# EAGLE design untitled (EAGLE 9.6.2)
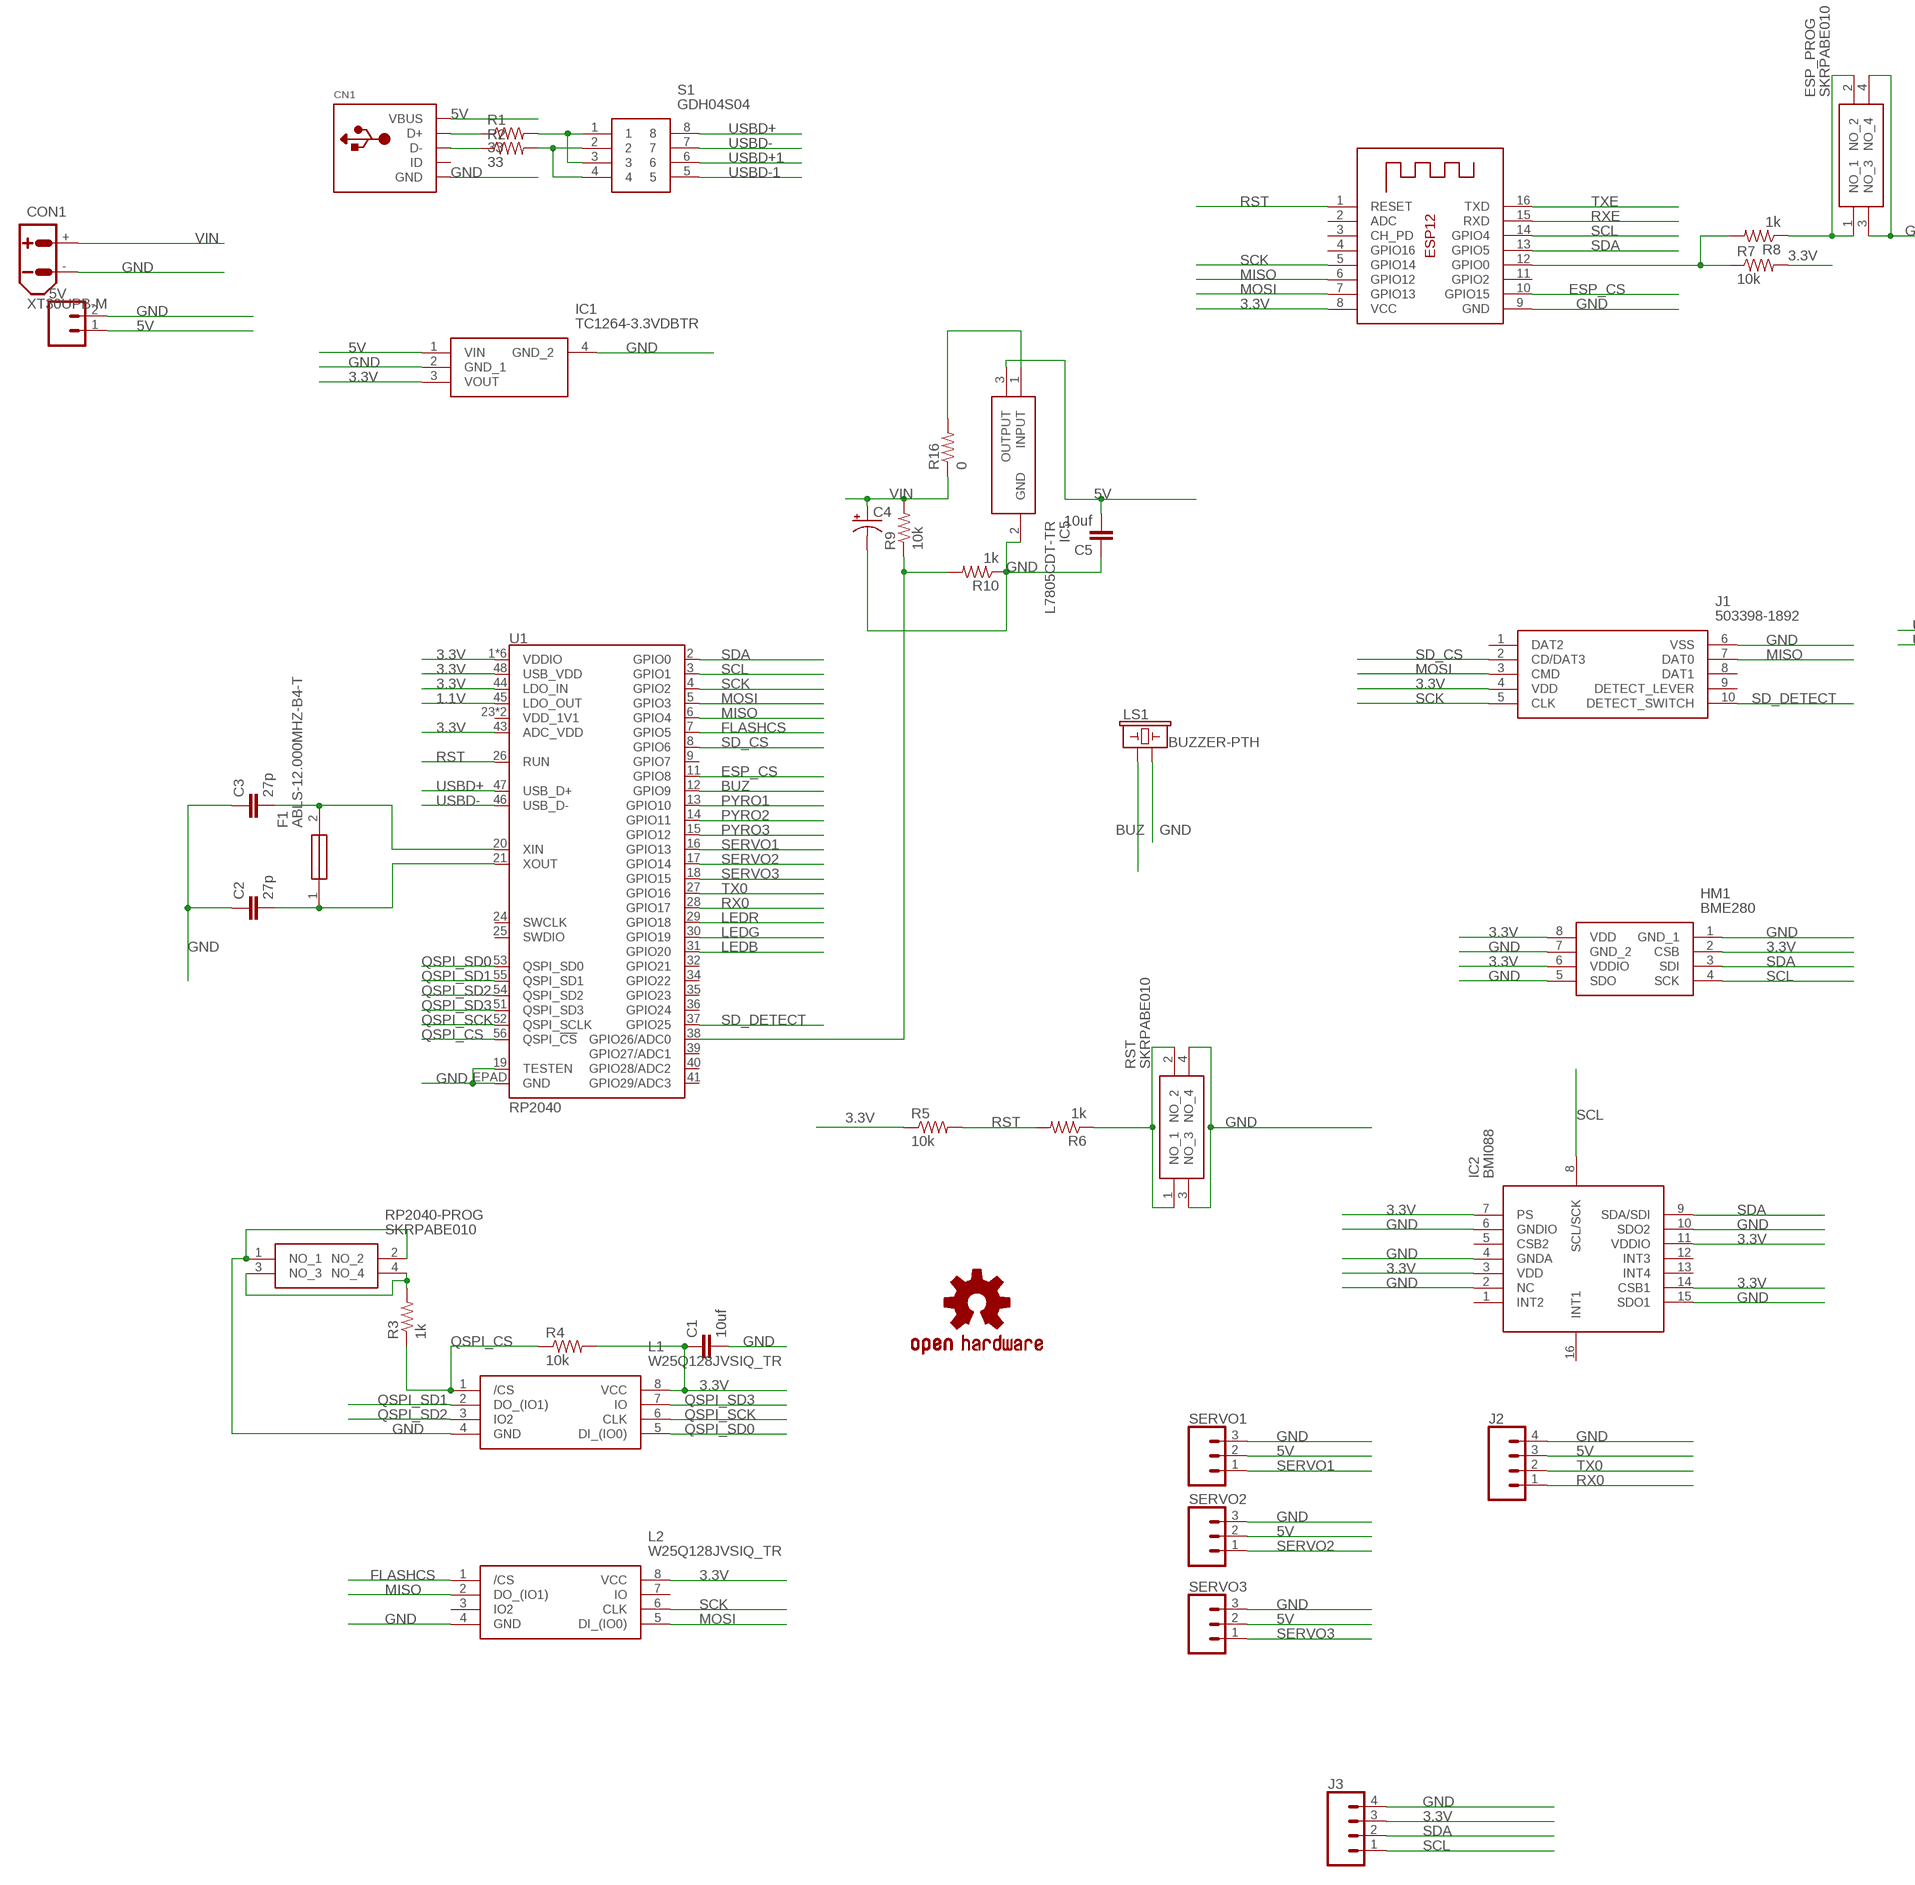
[diagram p0: schematic, sheet 1, part 1 of 2]
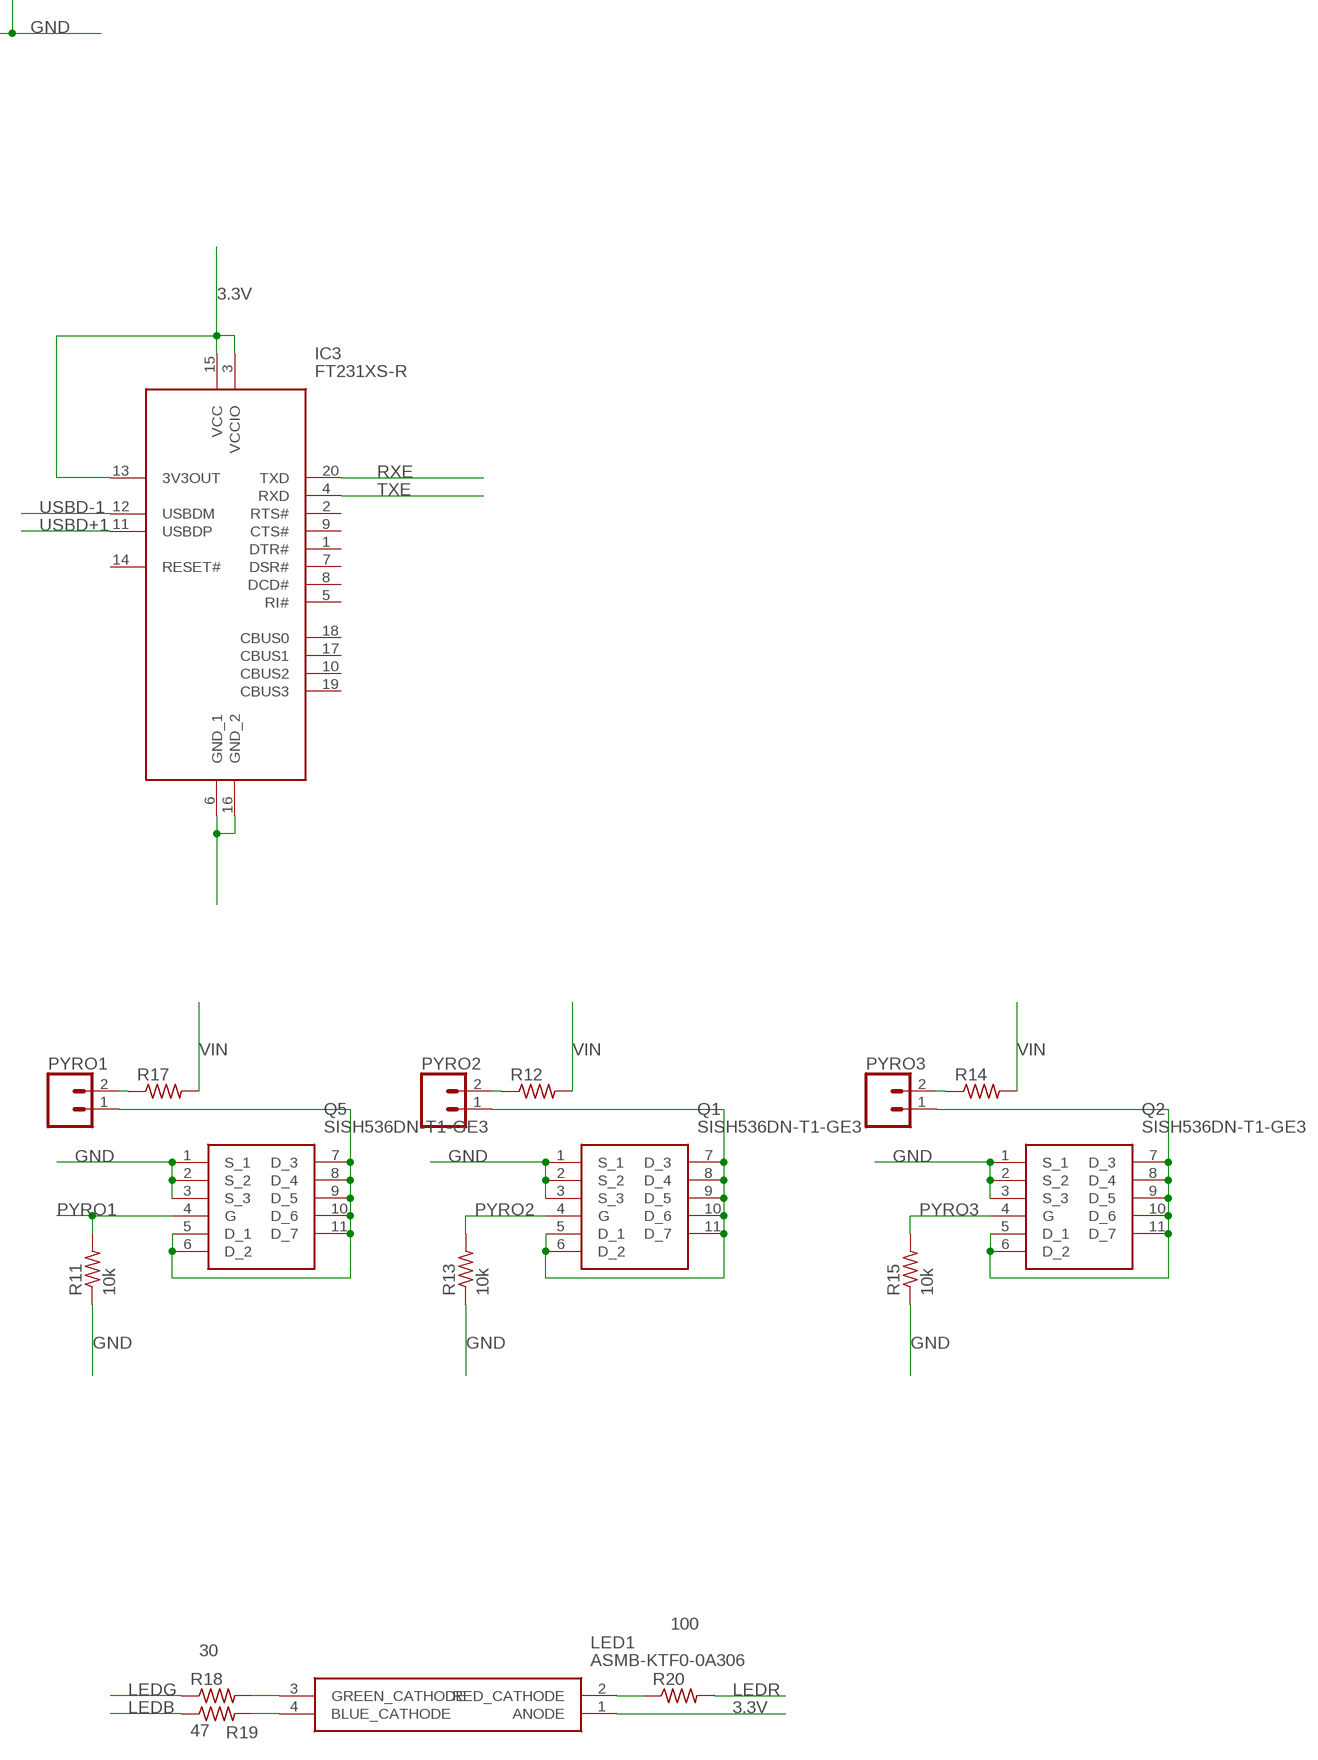
[diagram p1: schematic, sheet 1, part 2 of 2]

## Parts
5V  CONN_02  [1X02]
C1  10uf  C-EUC0805  [C0805]
C2  27p  C-EUC0805  [C0805]
C3  27p  C-EUC0805  [C0805]
C4  CPOL-USE3.5-8  [E3,5-8]
C5  10uf  C-EUC0805  [C0805]
CN1  USBMINIB  [USB-MINIB]
CON1  XT30UPB-M  [XT30UPB-M]
ESP_PROG  SKRPABE010  [SKRPABE010]
F1  ABLS-12.000MHZ-B4-T  [HC/49US-(AT49)_1]
HM1  BME280  [BME280]
IC1  TC1264-3.3VDBTR  [SOT230P700X180-4N]
IC2  BMI088  [BMI088]
IC3  FT231XS-R  [SOP64P599X175-20N]
IC5  L7805CDT-TR  [L7805CDTTR]
J1  503398-1892  [503398-1892]
J2  CONN_04  [1X04]
J3  CONN_04  [1X04]
L1  W25Q128JVSIQ_TR  [SOIC127P780X195-8N]
L2  W25Q128JVSIQ_TR  [SOIC127P780X195-8N]
LED1  ASMB-KTF0-0A306  [ASMBKTF00A306]
LOGO1  OSHW-LOGOS  [OSHW-LOGO-S]
LS1  BUZZER-PTH  [BUZZER-12MM]
PYRO1  CONN_025MM  [SCREWTERMINAL-5MM-2]
PYRO2  CONN_025MM  [SCREWTERMINAL-5MM-2]
PYRO3  CONN_025MM  [SCREWTERMINAL-5MM-2]
Q1  SISH536DN-T1-GE3  [SQSA80ENWT1_GE3]
Q2  SISH536DN-T1-GE3  [SQSA80ENWT1_GE3]
Q5  SISH536DN-T1-GE3  [SQSA80ENWT1_GE3]
R1  33  R-US_M0805  [M0805]
R2  33  R-US_M0805  [M0805]
R3  1k  R-US_M0805  [M0805]
R4  10k  R-US_M0805  [M0805]
R5  10k  R-US_M0805  [M0805]
R6  1k  R-US_M0805  [M0805]
R7  10k  R-US_M0805  [M0805]
R8  1k  R-US_M0805  [M0805]
R9  10k  R-US_M0805  [M0805]
R10  1k  R-US_M0805  [M0805]
R11  10k  R-US_M0805  [M0805]
R12  0  R-US_R2512  [R2512]
R13  10k  R-US_M0805  [M0805]
R14  0  R-US_R2512  [R2512]
R15  10k  R-US_M0805  [M0805]
R16  0  R-US_R2512  [R2512]
R17  0  R-US_R2512  [R2512]
R18  30  R-US_M0805  [M0805]
R19  47  R-US_M0805  [M0805]
R20  100  R-US_M0805  [M0805]
RP2040-PROG  SKRPABE010  [SKRPABE010]
RST  SKRPABE010  [SKRPABE010]
S1  GDH04S04  [SOIC127P813X256-8N]
SERVO1  CONN_03  [1X03]
SERVO2  CONN_03  [1X03]
SERVO3  CONN_03  [1X03]
U1  RP2040  [QFN-56]
X1  ESP-12  [ESP-12]

## Nets
1.1V: U1.45(LDO_OUT)
3.3V: C1.1 HM1.2(CSB) HM1.6(VDDIO) HM1.8(VDD) IC1.3(VOUT) IC2.3(VDD) IC2.7(PS) IC2.11(VDDIO) IC2.14(CSB1) IC3.3(VCCIO) IC3.13(3V3OUT) IC3.15(VCC) J1.4(VDD) J3.3 L1.8(VCC) L2.8(VCC) LED1.1(ANODE) R4.2 R5.1 R7.2 U1.1(VDDIO) U1.10(VDDIO) U1.22(VDDIO) U1.33(VDDIO) U1.42(VDDIO) U1.43(ADC_VDD) U1.44(LDO_IN) U1.48(USB_VDD) U1.49(VDDIO) X1.8(VCC)
5V: 5V.1 C5.2 CN1.VBUS IC1.1(VIN) IC5.3(OUTPUT) J2.3 SERVO1.2 SERVO2.2 SERVO3.2
BUZ: LS1.+ U1.12(GPIO9)
ESP_CS: U1.11(GPIO8) X1.10(GPIO15)
FLASHCS: L2.1(/CS) U1.7(GPIO5)
GND: 5V.2 C1.2 C2.1 C3.1 C4.- C5.1 CN1.GND CON1.- ESP_PROG.3(NO_3) ESP_PROG.4(NO_4) HM1.1(GND_1) HM1.5(SDO) HM1.7(GND_2) IC1.2(GND_1) IC1.4(GND_2) IC2.2(NC) IC2.4(GNDA) IC2.6(GNDIO) IC2.10(SDO2) IC2.15(SDO1) IC5.2(GND) J1.6(VSS) J2.4 J3.4 L1.4(GND) L2.4(GND) LS1.- Q1.1(S_1) Q1.2(S_2) Q1.3(S_3) Q2.1(S_1) Q2.2(S_2) Q2.3(S_3) Q5.1(S_1) Q5.2(S_2) Q5.3(S_3) R10.1 R11.1 R13.1 R15.1 RP2040-PROG.1(NO_1) RP2040-PROG.2(NO_2) RST.3(NO_3) RST.4(NO_4) SERVO1.3 SERVO2.3 SERVO3.3 U1.19(TESTEN) U1.EPAD(GND) X1.9(GND)
LEDB: R19.1 U1.31(GPIO20)
LEDG: R18.1 U1.30(GPIO19)
LEDR: R20.2 U1.29(GPIO18)
MISO: J1.7(DAT0) L2.2(DO_(IO1)) U1.6(GPIO4) X1.6(GPIO12)
MOSI: J1.3(CMD) L2.5(DI_(IO0)) U1.5(GPIO3) X1.7(GPIO13)
N$1: PYRO2.2 R12.1
N$2: R3.2 RP2040-PROG.3(NO_3) RP2040-PROG.4(NO_4)
N$3: ESP_PROG.1(NO_1) ESP_PROG.2(NO_2) R8.1
N$4: R6.1 RST.1(NO_1) RST.2(NO_2)
N$5: CN1.D+ R1.1
N$6: CN1.D- R2.1
N$7: PYRO2.1 Q1.5(D_1) Q1.6(D_2) Q1.7(D_3) Q1.8(D_4) Q1.9(D_5) Q1.10(D_6) Q1.11(D_7)
N$8: PYRO3.2 R14.1
N$9: PYRO1.1 Q5.5(D_1) Q5.6(D_2) Q5.7(D_3) Q5.8(D_4) Q5.9(D_5) Q5.10(D_6) Q5.11(D_7)
N$10: R7.1 R8.2 X1.12(GPIO0)
N$11: PYRO3.1 Q2.5(D_1) Q2.6(D_2) Q2.7(D_3) Q2.8(D_4) Q2.9(D_5) Q2.10(D_6) Q2.11(D_7)
N$12: IC3.6(GND_1) IC3.16(GND_2)
N$13: R1.2 S1.1 S1.3
N$14: IC5.1(INPUT) R16.2
N$16: PYRO1.2 R17.1
N$17: R2.2 S1.2 S1.4
N$18: C3.2 F1.2 U1.20(XIN)
N$19: C2.2 F1.1 U1.21(XOUT)
N$23: LED1.3(GREEN_CATHODE) R18.2
N$24: R9.1 R10.2 U1.38(GPIO26/ADC0)
N$25: LED1.4(BLUE_CATHODE) R19.2
N$26: LED1.2(RED_CATHODE) R20.1
PYRO1: Q5.4(G) R11.2 U1.13(GPIO10)
PYRO2: Q1.4(G) R13.2 U1.14(GPIO11)
PYRO3: Q2.4(G) R15.2 U1.15(GPIO12)
QSPI_CS: L1.1(/CS) R3.1 R4.1 U1.56(QSPI_!CS!)
QSPI_SCK: L1.6(CLK) U1.52(QSPI_SCLK)
QSPI_SD0: L1.5(DI_(IO0)) U1.53(QSPI_SD0)
QSPI_SD1: L1.2(DO_(IO1)) U1.55(QSPI_SD1)
QSPI_SD2: L1.3(IO2) U1.54(QSPI_SD2)
QSPI_SD3: L1.7(IO) U1.51(QSPI_SD3)
RST: R5.2 R6.2 U1.26(RUN) X1.1(RESET)
RX0: J2.1 U1.28(GPIO17)
RXE: IC3.20(TXD) X1.15(RXD)
SCK: J1.5(CLK) L2.6(CLK) U1.4(GPIO2) X1.5(GPIO14)
SCL: HM1.4(SCK) IC2.8(SCL/SCK) J3.1 U1.3(GPIO1) X1.14(GPIO4)
SD_CS: J1.2(CD/DAT3) U1.8(GPIO6)
SD_DETECT: J1.10(DETECT_SWITCH) U1.37(GPIO25)
SDA: HM1.3(SDI) IC2.9(SDA/SDI) J3.2 U1.2(GPIO0) X1.13(GPIO5)
SERVO1: SERVO1.1 U1.16(GPIO13)
SERVO2: SERVO2.1 U1.17(GPIO14)
SERVO3: SERVO3.1 U1.18(GPIO15)
TX0: J2.2 U1.27(GPIO16)
TXE: IC3.4(RXD) X1.16(TXD)
USBD+: S1.8 U1.47(USB_D+)
USBD+1: IC3.11(USBDP) S1.6
USBD-: S1.7 U1.46(USB_D-)
USBD-1: IC3.12(USBDM) S1.5
VIN: C4.+ CON1.+ R9.2 R12.2 R14.2 R16.1 R17.2
Unconnected: CN1.ID IC2.1(INT2) IC2.5(CSB2) IC2.12(INT3) IC2.13(INT4) IC2.16(INT1) IC3.1(DTR#) IC3.2(RTS#) IC3.5(RI#) IC3.7(DSR#) IC3.8(DCD#) IC3.9(CTS#) IC3.10(CBUS2) IC3.14(RESET#) IC3.17(CBUS1) IC3.18(CBUS0) IC3.19(CBUS3) J1.1(DAT2) J1.8(DAT1) J1.9(DETECT_LEVER) L2.3(IO2) L2.7(IO) U1.9(GPIO7) U1.23(VDD_1V1) U1.24(SWCLK) U1.25(SWDIO) U1.32(GPIO21) U1.34(GPIO22) U1.35(GPIO23) U1.36(GPIO24) U1.39(GPIO27/ADC1) U1.40(GPIO28/ADC2) U1.41(GPIO29/ADC3) U1.50(VDD_1V1) X1.2(ADC) X1.3(CH_PD) X1.4(GPIO16) X1.11(GPIO2)

## Library data of the parts
5V = SparkFun-Connectors:CONN_02: Multi connection point. Often used as Generic Header-pin footprint for 0.1 inch spaced/style header connections On any of the 0.1 inch spaced packages, you can populate with these: Break Away Headers - Straight <https://www.sparkfun.com/products/116> (PRT-00116) Break Away Male Headers - Right Angle <https://www.sparkfun.com/products/553> (PRT-00553) Female Headers <https://www.sparkfun.com/products/115> (PRT-00115) Break Away Headers - Machine Pin <https://www.sparkfun.com/products/117> (PRT-00117) Break Away Female Headers - Swiss Machine Pin <https://www.sparkfun.com/products/743> (PRT-00743) For SCREWTERMINALS and SPRING TERMINALS visit here: Screw Terimnals on SparkFun.com <https://www.sparkfun.com/search/results?term=Screw+Terminals> (5mm/3.5mm/2.54mm spacing) This device is also useful as a general connection point to wire up your design to another part of your project. Our various solder wires solder well into these plated through hole pads. Hook-Up Wire - Assortment (Stranded, 22 AWG) <https://www.sparkfun.com/products/11375> (PRT-11375) Hook-Up Wire - Assortment (Solid Core, 22 AWG) <https://www.sparkfun.com/products/11367> (PRT-11367) View the entire wire category on our website here <https://www.sparkfun.com/categories/141> Special notes: Molex polarized connector foot print use with: PRT-08233 with associated crimp pins and housings. 2.54_SCREWTERM for use with PRT-10571. 3.5mm Screw Terminal footprints for PRT-08084 5mm Screw Terminal footprints for use with PRT-08432
C1-C3 C5 = rcl:C-EU: CAPACITOR, European symbol; SPICEPREFIX: C
C4 = rcl:CPOL-US: POLARIZED CAPACITOR, American symbol; SPICEPREFIX: C
CN1 = adafruit:USB: USB Connectors USBMINIB - Surface Mount Female Mini-B USB Connector 4UConnector: 06564 By microbuilder.eu Thru-hole RA Female Mini-B USB Connector 4UConnector: 18732 By ladyada.net
CON1 = amass:XT30: AMASS XT30 connector Store in Japan AMASS XT30 connector <https://szc.jp/ams-xt30>
ESP_PROG RP2040-PROG RST = SKRPABE010:SKRPABE010: Switch Tactile N.O. SPST Button J-Bend 0.05A 16VDC 1.57N SMD Automotive T/R Source: Datasheet <https://datasheet.lcsc.com/szlcsc/ALPS-Electric-SKRPABE010_C115360.pdf>; DESCRIPTION: Switch Tactile N.O. SPST Button J-Bend 0.05A 16VDC 1.57N SMD Automotive T/R; HEIGHT: 2.5mm; MANUFACTURER_NAME: ALPS Electric; MANUFACTURER_PART_NUMBER: SKRPABE010; MOUSER_PART_NUMBER: 688-SKRPAB; MOUSER_PRICE-STOCK: https://www.mouser.co.uk/ProductDetail/Alps-Alpine/SKRPABE010?qs=m0BA540hBPe1GpcSf%2FZ5Yw%3D%3D
F1 = ABLS-12.000MHZ-B4-T:ABLS-12.000MHZ-B4-T: ABRACON - ABLS-12.000MHZ-B4-T - CRYSTAL, 12MHZ, 18PF, HC-49US Source: Datasheet <https://componentsearchengine.com/Datasheets/2/ABLS-12.000MHZ-B4-T.pdf>; DESCRIPTION: ABRACON - ABLS-12.000MHZ-B4-T - CRYSTAL, 12MHZ, 18PF, HC-49US; HEIGHT: mm; MANUFACTURER_NAME: ABRACON; MANUFACTURER_PART_NUMBER: ABLS-12.000MHZ-B4-T; MOUSER_PART_NUMBER: 815-ABLS-12.0M-T; MOUSER_PRICE-STOCK: https://www.mouser.co.uk/ProductDetail/ABRACON/ABLS-12.000MHZ-B4-T?qs=yTU0IcKoRlGSQ8ooxPPVnQ%3D%3D
HM1 = BME280:BME280: Board Mount Humidity Sensors Source: Datasheet <https://datasheet.datasheetarchive.com/originals/distributors/DKDS-24/462906.pdf>; DESCRIPTION: Board Mount Humidity Sensors; HEIGHT: mm; MANUFACTURER_NAME: BOSCH; MANUFACTURER_PART_NUMBER: BME280; MOUSER_PART_NUMBER: 262-BME280; MOUSER_PRICE-STOCK: https://www.mouser.co.uk/ProductDetail/Bosch-Sensortec/BME280?qs=2OnyuXx6vpj2fK9HX7qb3g%3D%3D
IC1 = TC1264-3.3VDBTR:TC1264-3.3VDBTR: LDO Voltage Regulators 800mA Fixed Output Source: Datasheet; DESCRIPTION: LDO Voltage Regulators 800mA Fixed Output; HEIGHT: 1.8mm; MANUFACTURER_NAME: Microchip; MANUFACTURER_PART_NUMBER: TC1264-3.3VDBTR; MOUSER_PART_NUMBER: 579-TC1264-3.3VDBTR; MOUSER_PRICE-STOCK: https://www.mouser.co.uk/ProductDetail/Microchip-Technology-Atmel/TC1264-3.3VDBTR?qs=EkZBwCRGcSs72PT5fOeaFg%3D%3D
IC2 = BMI088:BMI088: Inertial Measurement Unit Digital Output 2.5V/3.3V Automotive Source: Datasheet <https://datasheet.datasheetarchive.com/originals/distributors/Datasheets_SAMA/994c3bf88e91a9e9fead6a819d348e4d.pdf>; DESCRIPTION: Inertial Measurement Unit Digital Output 2.5V/3.3V Automotive; HEIGHT: 1.45mm; MANUFACTURER_NAME: BOSCH; MANUFACTURER_PART_NUMBER: BMI088; MOUSER_PART_NUMBER: 262-BMI088; MOUSER_PRICE-STOCK: https://www.mouser.co.uk/ProductDetail/Bosch-Sensortec/BMI088?qs=f9yNj16SXrIMFspTV6RB6Q%3D%3D
IC3 = FT231XS-R:FT231XS-R: FTDI Chip FT231XS-R, Interface RS232, RS422, RS485, SIE, UART 3MBd, 5 V, 20-pin, SSOP Source: Datasheet <https://datasheet.datasheetarchive.com/originals/distributors/Datasheets_SAMA/824938d1687833d6997706543241551a.pdf>; DESCRIPTION: FTDI Chip FT231XS-R, Interface RS232, RS422, RS485, SIE, UART 3MBd, 5 V, 20-pin, SSOP; HEIGHT: 1.753mm; MANUFACTURER_NAME: FTDI Chip; MANUFACTURER_PART_NUMBER: FT231XS-R; MOUSER_PART_NUMBER: 895-FT231XS-R; MOUSER_PRICE-STOCK: https://www.mouser.co.uk/ProductDetail/FTDI/FT231XS-R?qs=Gp1Yz1mis3WduRPsgrTbtg%3D%3D
IC5 = L7805CDT-TR:L7805CDT-TR: Linear Voltage Regulators 5.0V 1.0A Positive Source: Datasheet <https://componentsearchengine.com/Datasheets/2/L7805CDT-TR.pdf>; DESCRIPTION: Linear Voltage Regulators 5.0V 1.0A Positive; HEIGHT: 2.63mm; MANUFACTURER_NAME: STMicroelectronics; MANUFACTURER_PART_NUMBER: L7805CDT-TR; MOUSER_PART_NUMBER: 511-L7805CDT-TR; MOUSER_PRICE-STOCK: https://www.mouser.co.uk/ProductDetail/STMicroelectronics/L7805CDT-TR?qs=gq%2F78KzUDX67VndS%2FbSB4Q%3D%3D
J1 = 503398-1892:503398-1892: MicroSD SMT Push-Push 1.28mm height MicroSD SMT Push-Push 1.28mm height Source: Datasheet <http://www.molex.com/webdocs/datasheets/pdf/en-us//5033981892_MEMORY_CARD_SOCKET.pdf>; DESCRIPTION: MicroSD SMT Push-Push 1.28mm height MicroSD SMT Push-Push 1.28mm height; HEIGHT: mm; MANUFACTURER_NAME: Molex; MANUFACTURER_PART_NUMBER: 503398-1892; MOUSER_PART_NUMBER: 538-503398-1892; MOUSER_PRICE-STOCK: https://www.mouser.co.uk/ProductDetail/Molex/503398-1892?qs=b0v8CoHHvSMxV%252BW12iKaSg%3D%3D
J2 J3 = SparkFun-Connectors:CONN_04: Multi connection point. Often used as Generic Header-pin footprint for 0.1 inch spaced/style header connections On any of the 0.1 inch spaced packages, you can populate with these: Break Away Headers - Straight <https://www.sparkfun.com/products/116> (PRT-00116) Break Away Male Headers - Right Angle <https://www.sparkfun.com/products/553> (PRT-00553) Female Headers <https://www.sparkfun.com/products/115> (PRT-00115) Break Away Headers - Machine Pin <https://www.sparkfun.com/products/117> (PRT-00117) Break Away Female Headers - Swiss Machine Pin <https://www.sparkfun.com/products/743> (PRT-00743) For SCREWTERMINALS and SPRING TERMINALS visit here: Screw Terimnals on SparkFun.com <https://www.sparkfun.com/search/results?term=Screw+Terminals> (5mm/3.5mm/2.54mm spacing) This device is also useful as a general connection point to wire up your design to another part of your project. Our various solder wires solder well into these plated through hole pads. Hook-Up Wire - Assortment (Stranded, 22 AWG) <https://www.sparkfun.com/products/11375> (PRT-11375) Hook-Up Wire - Assortment (Solid Core, 22 AWG) <https://www.sparkfun.com/products/11367> (PRT-11367) View the entire wire category on our website here <https://www.sparkfun.com/categories/141> Special notes: Molex polarized connector foot print use with SKU : PRT-08231 with associated crimp pins and housings. 1MM SMD Version SKU: PRT-10208; PROD_ID: CONN-09696
L1 L2 = W25Q128JVSIQ_TR:W25Q128JVSIQ_TR: FLASH - NOR Memory IC 128Mb (16M x 8) SPI - Quad I/O 8-SOIC Source: Datasheet <http://www.winbond.com/resource-files/w25q128jv spi revc 11162016.pdf>; DESCRIPTION: FLASH - NOR Memory IC 128Mb (16M x 8) SPI - Quad I/O 8-SOIC; HEIGHT: 1.95mm; MANUFACTURER_NAME: Winbond; MANUFACTURER_PART_NUMBER: W25Q128JVSIQ TR; MOUSER_PART_NUMBER: 454-W25Q128JVSIQTR; MOUSER_PRICE-STOCK: https://www.mouser.co.uk/ProductDetail/Winbond/W25Q128JVSIQ-TR?qs=qSfuJ%252Bfl%2Fd7vTyLA9kNdGw%3D%3D
LED1 = ASMB-KTF0-0A306:ASMB-KTF0-0A306: Standard LEDs - SMD 2220 PLCC4 Tricolor Source: Datasheet <https://componentsearchengine.com/Datasheets/1/ASMB-KTF0-0A306.pdf>; DESCRIPTION: Standard LEDs - SMD 2220 PLCC4 Tricolor; HEIGHT: 2.1mm; MANUFACTURER_NAME: Avago Technologies; MANUFACTURER_PART_NUMBER: ASMB-KTF0-0A306; MOUSER_PART_NUMBER: 630-ASMB-KTF0-0A306; MOUSER_PRICE-STOCK: https://www.mouser.co.uk/ProductDetail/Broadcom-Avago/ASMB-KTF0-0A306?qs=j%252B1pi9TdxUYIaJsf%252B0lh6A%3D%3D
LOGO1 = SparkFun-Aesthetics:OSHW-LOGO: Open-Source Hardware (OSHW) Logo This logo indicates the piece of hardware it is found on incorporates a OSHW license and/or adheres to the definition of open source hardware found here: http://freedomdefined.org/OSHW
LS1 = SparkFun-Electromechanical:BUZZER: Buzzer Small round buzzers that operate around the audible 2kHz range. You can use these as speakers to create simple music or user interfaces. Variant Overview: PTH - Mini Speaker - PC Mount 12mm 2.048kHz <https://www.sparkfun.com/products/7950> PTH_KIT - Mini Speaker - PC Mount 12mm 2.048kHz <https://www.sparkfun.com/products/7950> KIT simplifies soldering by adding stop mask to one side of the pads. PTH_NO_SILK - Mini Speaker - PC Mount 12mm 2.048kHz <https://www.sparkfun.com/products/7950> No silkscreen indicator of buzzer outline. PTH_KIT_NO_SILK - Mini Speaker - PC Mount 12mm 2.048kHz <https://www.sparkfun.com/products/7950> KIT package w/o silkscreen SMD - Buzzer Audio Magnetic (CCV-084B16) SMD buzzer used on, e.g. the LilyPad Buzzer <https://www.sparkfun.com/products/8463> and RFID USB Reader <https://www.sparkfun.com/products/9963>. SMD_KIT - Buzzer Audio Magnetic (CCV-084B16) SMD Buzzer with elongated pins to make soldering easier. Used on the SparkFun Simon Says - Surface Mount Soldering Kit <https://www.sparkfun.com/products/10935>.; PROD_ID: COMP-08253; SF_SKU: COM-07950
PYRO1-PYRO3 = SparkFun-Connectors:CONN_02: Multi connection point. Often used as Generic Header-pin footprint for 0.1 inch spaced/style header connections On any of the 0.1 inch spaced packages, you can populate with these: Break Away Headers - Straight <https://www.sparkfun.com/products/116> (PRT-00116) Break Away Male Headers - Right Angle <https://www.sparkfun.com/products/553> (PRT-00553) Female Headers <https://www.sparkfun.com/products/115> (PRT-00115) Break Away Headers - Machine Pin <https://www.sparkfun.com/products/117> (PRT-00117) Break Away Female Headers - Swiss Machine Pin <https://www.sparkfun.com/products/743> (PRT-00743) For SCREWTERMINALS and SPRING TERMINALS visit here: Screw Terimnals on SparkFun.com <https://www.sparkfun.com/search/results?term=Screw+Terminals> (5mm/3.5mm/2.54mm spacing) This device is also useful as a general connection point to wire up your design to another part of your project. Our various solder wires solder well into these plated through hole pads. Hook-Up Wire - Assortment (Stranded, 22 AWG) <https://www.sparkfun.com/products/11375> (PRT-11375) Hook-Up Wire - Assortment (Solid Core, 22 AWG) <https://www.sparkfun.com/products/11367> (PRT-11367) View the entire wire category on our website here <https://www.sparkfun.com/categories/141> Special notes: Molex polarized connector foot print use with: PRT-08233 with associated crimp pins and housings. 2.54_SCREWTERM for use with PRT-10571. 3.5mm Screw Terminal footprints for PRT-08084 5mm Screw Terminal footprints for use with PRT-08432; SF_SKU: PRT-08432
Q1 Q2 Q5 = SISH536DN-T1-GE3:SISH536DN-T1-GE3: MOSFET N-CHANNEL 30-V (D-S) Source: Datasheet <https://www.vishay.com/docs/66834/sish536dn.pdf>; DESCRIPTION: MOSFET N-CHANNEL 30-V (D-S); HEIGHT: 1.12mm; MANUFACTURER_NAME: Vishay; MANUFACTURER_PART_NUMBER: SISH536DN-T1-GE3; MOUSER_PART_NUMBER: 78-SISH536DN-T1-GE3; MOUSER_PRICE-STOCK: https://www.mouser.co.uk/ProductDetail/Vishay-Siliconix/SISH536DN-T1-GE3?qs=DRkmTr78QATbyKNF%252BlMg2A%3D%3D
R1-R20 = resistor:R-US_: RESISTOR, American symbol
S1 = GDH04S04:GDH04S04: 4way half pitch surface mount DIL switch 4 Way Surface Mount DIP Switch 4P Source: Datasheet <http://www.te.com/commerce/DocumentDelivery/DDEController?Action=showdoc&DocId=Customer Drawing1571983C6pdfEnglishENG_CD_1571983_C6.pdf1571983-4>; DESCRIPTION: 4way half pitch surface mount DIL switch 4 Way Surface Mount DIP Switch 4P; HEIGHT: 2.56mm; MANUFACTURER_NAME: TE Connectivity; MANUFACTURER_PART_NUMBER: GDH04S04; MOUSER_PART_NUMBER: 506-GDH04S04; MOUSER_PRICE-STOCK: https://www.mouser.co.uk/ProductDetail/TE-Connectivity-Alcoswitch/GDH04S04?qs=wg6chLqwgwrFTPnUQOwjIg%3D%3D
SERVO1-SERVO3 = SparkFun-Connectors:CONN_03: Multi connection point. Often used as Generic Header-pin footprint for 0.1 inch spaced/style header connections On any of the 0.1 inch spaced packages, you can populate with these: Break Away Headers - Straight <https://www.sparkfun.com/products/116> (PRT-00116) Break Away Male Headers - Right Angle <https://www.sparkfun.com/products/553> (PRT-00553) Female Headers <https://www.sparkfun.com/products/115> (PRT-00115) Break Away Headers - Machine Pin <https://www.sparkfun.com/products/117> (PRT-00117) Break Away Female Headers - Swiss Machine Pin <https://www.sparkfun.com/products/743> (PRT-00743) Stackable Header - 3 Pin (Female, 0.1") <https://www.sparkfun.com/products/13875> (PRT-13875) For SCREWTERMINALS and SPRING TERMINALS visit here: Screw Terimnals on SparkFun.com <https://www.sparkfun.com/search/results?term=Screw+Terminals> (5mm/3.5mm/2.54mm spacing) This device is also useful as a general connection point to wire up your design to another part of your project. Our various solder wires solder well into these plated through hole pads. Hook-Up Wire - Assortment (Stranded, 22 AWG) <https://www.sparkfun.com/products/11375> (PRT-11375) Hook-Up Wire - Assortment (Solid Core, 22 AWG) <https://www.sparkfun.com/products/11367> (PRT-11367) View the entire wire category on our website here <https://www.sparkfun.com/categories/141> Special notes: Molex polarized connector foot print use with SKU : PRT-08232 with associated crimp pins and housings.
U1 = SparkFun-IC-Microcontroller:RP2040: Raspberry Pi RP2040 MCU 56-pin 32-bit Microcontroller with 264kB of SRAM and external flash support up to 16MB Getting Started with the RP2040 <https://pico.raspberrypi.org/getting-started/> Dual-core ARM Cortex M0+ processor, flexible clock running up to 133 MHz 264kB of SRAM, and QSPI control of common flash memory USB 1.1 Host and Device support Low-power sleep and dormant modes Drag & drop programming using mass storage over USB 26 multi-function GPIO pins 2×SPI, 2×I2C, 2×UART, 3×12-bit ADC, 16×controllable PWM channels Accurate clock and timer on-chip Temperature sensor Accelerated floating point libraries on-chip 8×Programmable IO (PIO) state machines for custom peripheral support; PROD_ID: IC-15502
X1 = adafruit:ESP-12

## Board
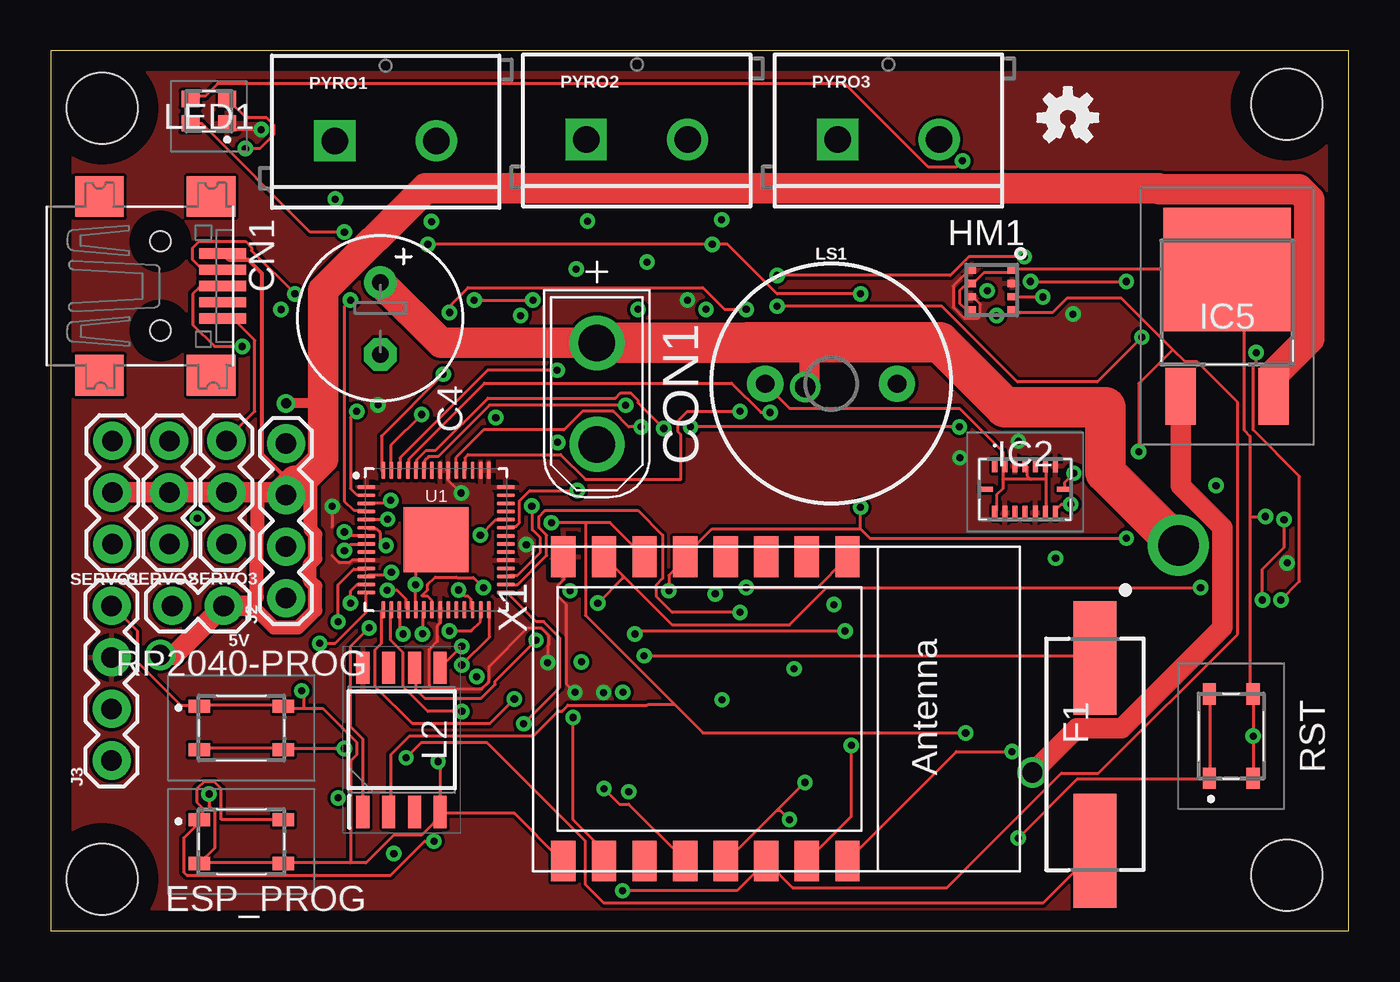
[diagram p2: board, top side]
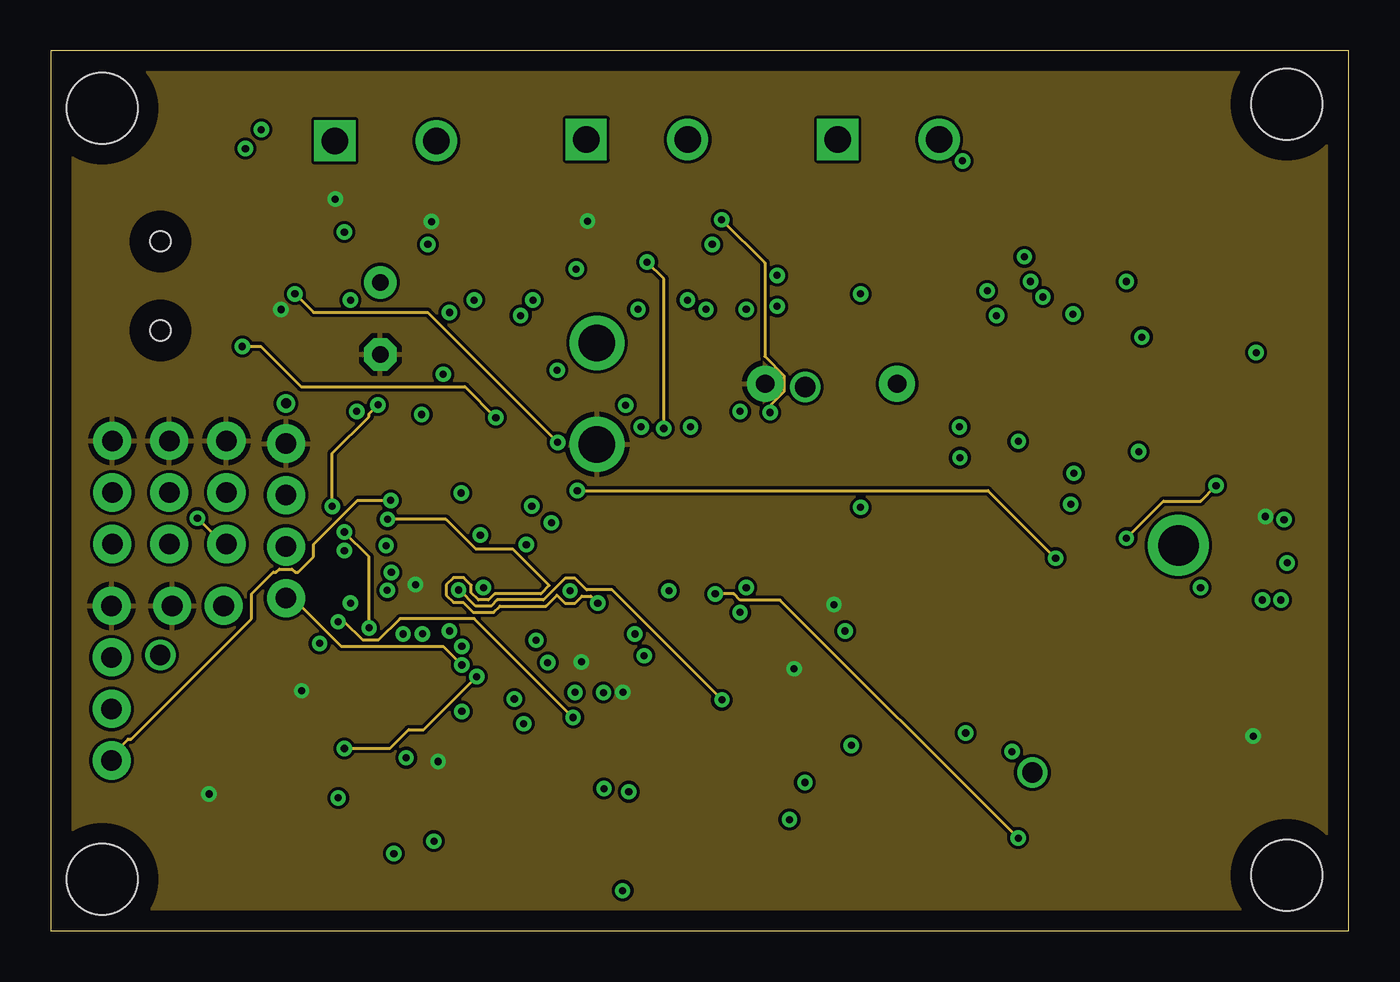
[diagram p3: board, inner layer Route2]
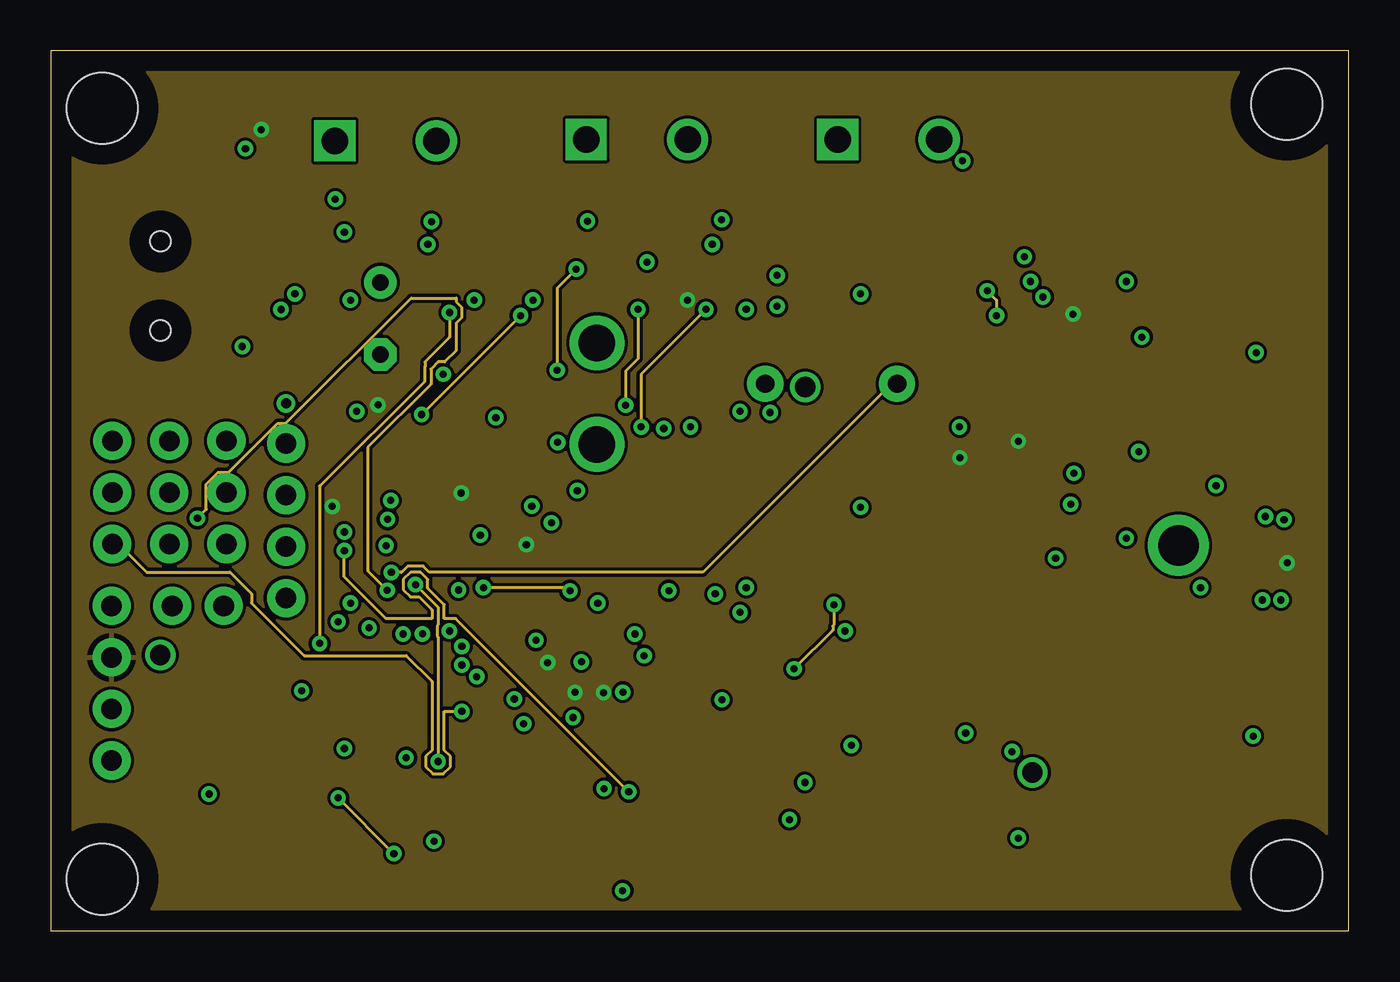
[diagram p4: board, inner layer Route15]
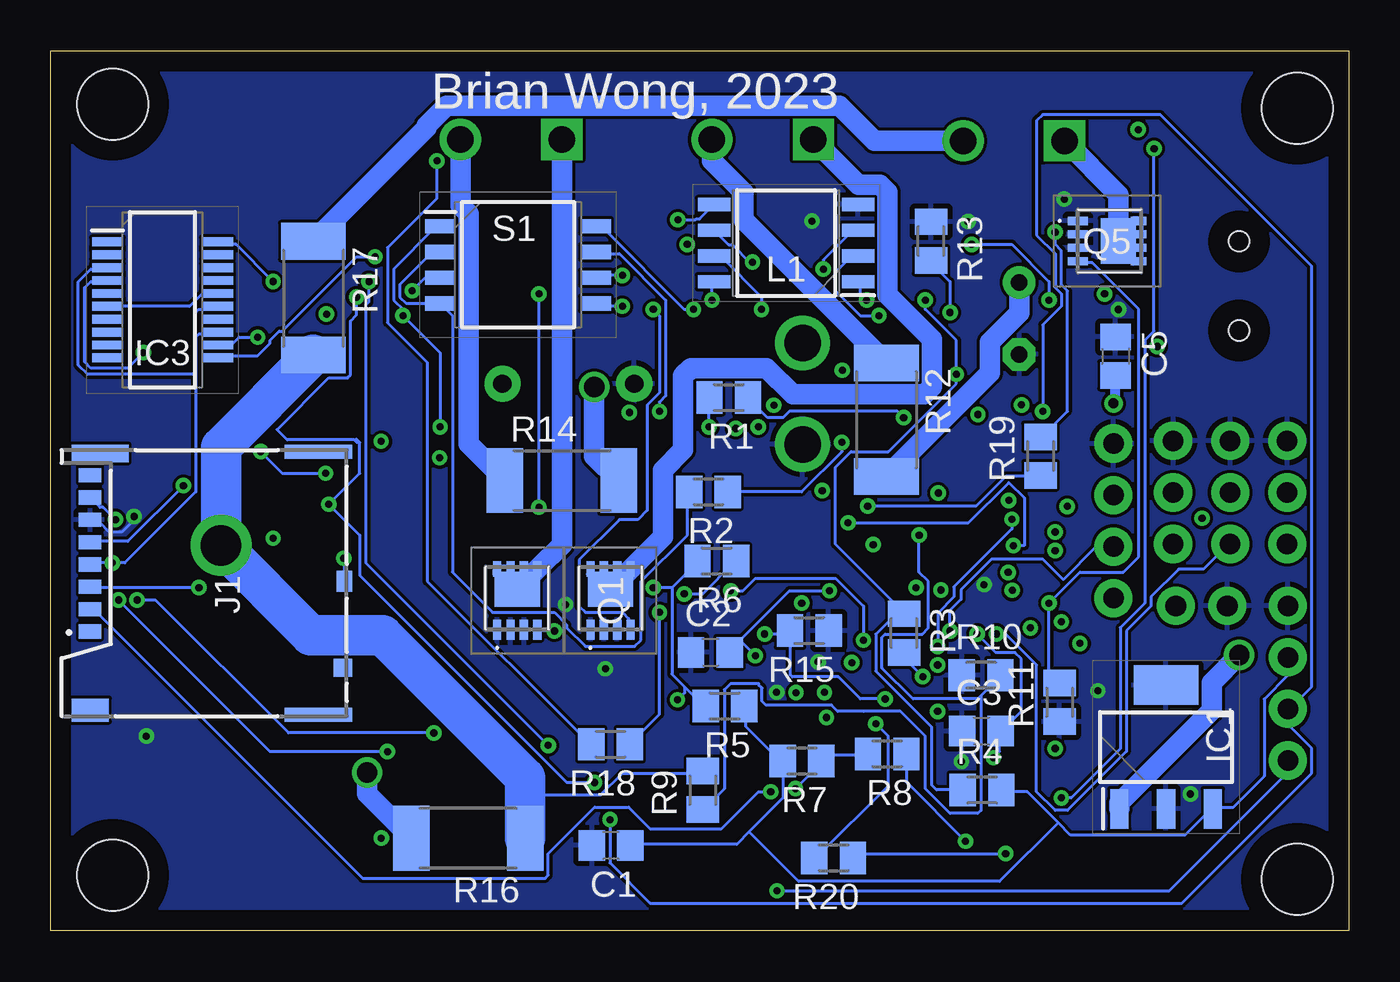
[diagram p5: board, bottom side, seen from below]

Size 64 x 43.38 mm. Coordinates in mm from the lower left corner, seen from the top.
Outline: 0,0 64,0 64,43.38 0,43.38 0,0
Copper layers (1+2*15+16): Top 0.035mm / dielectric 1.5mm / Route2 0.035mm / dielectric 0.15mm / Route15 0.035mm / dielectric 0.2mm / Bottom 0.035mm
Design rules "default *": minimum track width 6mil, minimum drill 0.35mm, track to track 6mil, track to pad 6mil, pad to pad 6mil, via to via 6mil, smd to smd 6mil, copper to edge 40mil, drill to drill 6mil, minimum pad ring 10mil, minimum via ring 8mil, stop-mask expansion 4mil, vias tented up to drill 0mil, thermal gap 10mil
Holes 3.5 mm at 2.54,2.54 60.94,2.74 2.54,40.54 60.94,40.74

### Footprints (pad centres in the part's own frame; a part is rotated, then mirrored left to right if it is on the bottom)
1X02 = drill 1.016 pad 1.88: 1 0,0; 2 2.54,0
C0805 = smd 1.3 x 1.5: 1 -0.95,0; 2 0.95,0
E3,5-8 = drill 0.813 pad 1.6: + -1.778,0 | drill 0.813 pad 1.6 octagon: - 1.778,0
USB-MINIB = smd 0.5 x 2.308: D+ 0,4.064; D- -0.8,4.064; GND 1.6,4.064; ID 0.8,4.064; VBUS -1.6,4.064 | smd 2 x 2.4: GND1 -4.4,-2; GND2 -4.4,3.5; GND3 4.4,3.5; GND4 4.4,-2 | hole 1: -2.2,1; 2.2,1
XT30UPB-M = drill 1.8: + 2.5,0; - -2.5,0
SKRPABE010 = smd 1.05 x 0.65: 1 -2.075,1.075; 2 2.075,1.075; 3 -2.075,-1.075; 4 2.075,-1.075
HC/49US-(AT49)_1 = smd 5.6 x 2.1: 1 -4.75,0; 2 4.75,0
BME280 = smd 0.5 x 0.35: 1 2.05,0; 2 2.05,-0.65; 3 2.05,-1.3; 4 2.05,-1.95; 5 0,-1.95; 6 0,-1.3; 7 0,-0.65; 8 0,0
SOT230P700X180-4N = smd 1.95 x 0.9: 1 -3.05,2.3; 2 -3.05,0; 3 -3.05,-2.3 | smd 1.95 x 3.2: 4 3.05,0
BMI088 = smd 0.25 x 0.675: 1 -1.5,1.165; 2 -1,1.165; 3 -0.5,1.165; 4 0,1.165; 5 0.5,1.165; 6 1,1.165; 7 1.5,1.165; 9 1.5,-1.165; 10 1,-1.165; 11 0.5,-1.165; 12 0,-1.165; 13 -0.5,-1.165; 14 -1,-1.165; 15 -1.5,-1.165 | smd 0.675 x 0.25: 8 1.915,0; 16 -1.915,0
SOP64P599X175-20N = smd 1.526 x 0.435: 1 -2.712,2.858; 2 -2.712,2.222; 3 -2.712,1.588; 4 -2.712,0.952; 5 -2.712,0.318; 6 -2.712,-0.318; 7 -2.712,-0.952; 8 -2.712,-1.588; 9 -2.712,-2.222; 10 -2.712,-2.858; 11 2.712,-2.858; 12 2.712,-2.222; 13 2.712,-1.588; 14 2.712,-0.952; 15 2.712,-0.318; 16 2.712,0.318; 17 2.712,0.952; 18 2.712,1.588; 19 2.712,2.222; 20 2.712,2.858
L7805CDTTR = smd 1.5 x 2.8: 1 -2.286,-6.25; 3 2.286,-6.25 | smd 6.3 x 6.1: 2 0,0
503398-1892 = smd 0.7 x 1.1: 1 4.17,-1.4; 2 5.27,-1.4; 3 6.37,-1.4; 4 7.47,-1.4; 5 8.57,-1.4; 6 9.67,-1.4; 7 10.77,-1.4; 8 11.87,-1.4 | smd 0.9 x 0.93: 9 2.38,-13.865 | smd 1.05 x 0.78: 10 6.645,-13.94 | smd 0.7 x 3.33: 11 13.03,-12.665; 14 0.07,-12.665 | smd 0.86 x 2.8: 12 12.95,-1.9 | smd 1.14 x 1.83: 13 0.29,-1.415
1X04 = drill 1.016 pad 1.88: 1 0,0; 2 2.54,0; 3 5.08,0; 4 7.62,0
SOIC127P780X195-8N = smd 1.6 x 0.65: 1 -3.55,1.905; 2 -3.55,0.635; 3 -3.55,-0.635; 4 -3.55,-1.905; 5 3.55,-1.905; 6 3.55,-0.635; 7 3.55,0.635; 8 3.55,1.905
ASMBKTF00A306 = smd 0.9 x 0.8: 1 0.9,-0.6; 2 0.9,0.6; 3 -0.9,0.6; 4 -0.9,-0.6
BUZZER-12MM = drill 0.9 pad 1.778: + 3.25,0; - -3.25,0
SCREWTERMINAL-5MM-2 = drill 1.3 pad 2.032 square: 1 0,0 | drill 1.3 pad 2.032: 2 5,0
SQSA80ENWT1_GE3 = smd 0.99 x 0.405: 1 -1.555,0.99; 2 -1.555,0.33; 3 -1.555,-0.33; 4 -1.555,-0.99 | smd 0.51 x 0.405: 5 1.555,-0.99; 6 1.555,-0.33; 7 1.555,0.33; 8 1.555,0.99 | smd 1.725 x 2.235: 9 0.438,0 | smd 0.25 x 0.075: 10 1.175,1.155; 11 1.175,-1.155
M0805 = smd 1.3 x 1.6: 1 -0.95,0; 2 0.95,0
R2512 = smd 1.8 x 3.2: 1 -2.8,0; 2 2.8,0
SOIC127P813X256-8N = smd 1.475 x 0.7: 1 -3.838,1.905; 2 -3.838,0.635; 3 -3.838,-0.635; 4 -3.838,-1.905; 5 3.838,-1.905; 6 3.838,-0.635; 7 3.838,0.635; 8 3.838,1.905
1X03 = drill 1.016 pad 1.88: 1 0,0; 2 2.54,0; 3 5.08,0
QFN-56 = smd 0.875 x 0.2: 1 -3.437,2.6; 2 -3.437,2.2; 3 -3.437,1.8; 4 -3.437,1.4; 5 -3.437,1; 6 -3.437,0.6; 7 -3.437,0.2; 8 -3.437,-0.2; 9 -3.437,-0.6; 10 -3.437,-1; 11 -3.437,-1.4; 12 -3.437,-1.8; 13 -3.437,-2.2; 14 -3.437,-2.6; 29 3.437,-2.6; 30 3.437,-2.2; 31 3.437,-1.8; 32 3.437,-1.4; 33 3.437,-1; 34 3.437,-0.6; 35 3.437,-0.2; 36 3.437,0.2; 37 3.437,0.6; 38 3.437,1; 39 3.437,1.4; 40 3.437,1.8; 41 3.437,2.2; 42 3.437,2.6 | smd 0.2 x 0.875: 15 -2.6,-3.437; 16 -2.2,-3.437; 17 -1.8,-3.437; 18 -1.4,-3.437; 19 -1,-3.437; 20 -0.6,-3.437; 21 -0.2,-3.437; 22 0.2,-3.437; 23 0.6,-3.437; 24 1,-3.437; 25 1.4,-3.437; 26 1.8,-3.437; 27 2.2,-3.437; 28 2.6,-3.437; 43 2.6,3.437; 44 2.2,3.437; 45 1.8,3.437; 46 1.4,3.437; 47 1,3.437; 48 0.6,3.437; 49 0.2,3.437; 50 -0.2,3.437; 51 -0.6,3.437; 52 -1,3.437; 53 -1.4,3.437; 54 -1.8,3.437; 55 -2.2,3.437; 56 -2.6,3.437 | smd 3.2 x 3.2: EPAD 0,0
ESP-12 = smd 2 x 1.2: 1 -7.5,4.5; 2 -7.5,2.5; 3 -7.5,0.5; 4 -7.5,-1.5; 5 -7.5,-3.5; 6 -7.5,-5.5; 7 -7.5,-7.5; 8 -7.5,-9.5; 9 7.5,-9.5; 10 7.5,-7.5; 11 7.5,-5.5; 12 7.5,-3.5; 13 7.5,-1.5; 14 7.5,0.5; 15 7.5,2.5; 16 7.5,4.5

### Placement (x,y rotation side)
5V  8.53,16.02 180 top
C1  36.37,4.21 180 bottom
C2  31.48,13.73 0 bottom
C3  18.12,9.85 0 bottom
C4  16.25,30.19 270 top
C5  11.5,28.33 270 bottom
CN1  4.41,31.79 270 top
CON1  26.93,26.48 90 top
ESP_PROG  9.4,4.4 0 top
F1  51.48,8.7 270 top
HM1  45.37,32.56 0 top
IC1  9.01,9.06 90 bottom
IC2  48.04,21.77 0 top
IC3  58.49,31.1 0 bottom
IC5  58,32.6 0 top
J1  63.46,10.59 90 bottom
J2  11.6,16.4 90 top
J3  3,8.4 90 top
L1  27.74,33.9 180 bottom
L2  17.3,9.42 90 top
LED1  7.8,40.4 0 top
LOGO1  50.15,40.08 0 top
LS1  38.48,26.97 0 top
PYRO1  14.01,38.94 0 top
PYRO2  26.4,39 0 top
PYRO3  38.8,39 0 top
Q1  36.4,16.4 90 bottom
Q2  41,16.4 90 bottom
Q5  11.8,34 0 bottom
R1  30.57,26.29 180 bottom
R2  31.57,21.64 180 bottom
R3  21.93,14.68 270 bottom
R4  18.08,6.95 0 bottom
R5  30.76,11.08 180 bottom
R6  31.16,18.23 180 bottom
R7  26.96,8.38 180 bottom
R8  22.76,8.73 180 bottom
R9  31.85,6.93 90 bottom
R10  18.13,12.6 0 bottom
R11  14.26,11.27 90 bottom
R12  22.8,25.2 270 bottom
R13  20.6,34 270 bottom
R14  38.8,22.2 0 bottom
R15  26.6,14.8 180 bottom
R16  43.41,4.57 180 bottom
R17  51.05,31.19 270 bottom
R18  36.4,9.2 180 bottom
R19  15.2,23.4 90 bottom
R20  25.4,3.6 180 bottom
RP2040-PROG  9.4,10 0 top
RST  58.2,9.6 90 top
S1  40.96,32.83 0 bottom
SERVO1  3.04,19.07 90 top
SERVO2  5.85,19.07 90 top
SERVO3  8.66,19.07 90 top
U1  19,19.27 0 top
X1  34.78,10.94 270 top

### Tracks (layer width: path | path; a pad name or v marks a point on that pad's centre or on a via)
3.3V  (via drill 0.35)
  Top 0.152: 19.51,22.71 U1.48 19.6,22.22 v20.24,21.58 | HM1.8 45.12,32.31 45.02,32.31 44.5,31.79 44.5,30.73 45.02,30.21 45.72,30.21 45.85,30.34 45.85,30.88 45.47,31.26 HM1.6 | U1.22 19.2,15.18 19.05,15.03 19.05,14.27 18.65,13.87 18.65,12.07 18.8,11.92 21.25,11.92 21.61,12.28 21.61,13.02 23.52,14.93 24.18,14.93 24.53,14.58 24.53,14.07 24.5,14.05 v24.5,13.22 | 13.87,18.49 14.23,18.14 14.73,18.14 14.86,18.27 U1.10 | 13.87,19.91 13.88,19.92 v13.88,20.93 | v10.38,39.49 9.01,39.49 LED1.1 | X1.8 25.28,17.3 25,17.02 25,16.51 25.42,16.09 25.42,12.19 v25.85,11.75
  Route2 0.152: v16.13,25.93 15.69,25.49 15.69,25.35 13.88,23.54 v13.88,20.93
  Bottom 0.152: 56.84,29.26 56.84,27.43 | 56.84,27.43 56.84,21.64 60.35,18.14 v60.96,18.14 62.03,18.14 J1.4 | 56.84,29.26 56.69,29.41 55.78,29.41 IC3.13 | 56.84,29.26 56.84,30.48 56.69,30.63 55.78,30.63 IC3.15 | 56.84,27.43 62.18,27.43 62.64,27.89 62.64,32 62.03,32.61 61.27,32.61 IC3.3 | 29.57,4.88 27.89,6.55 27.89,8.23 R7.2 28.04,8.38 29.72,10.06 29.72,10.97 R5.1 | 29.57,4.88 30.18,4.27 35.36,4.27 C1.1 | 14.33,5.33 13.72,4.72 8.08,4.72 6.86,5.94 IC1.3 6.71,6.08 5.71,6.08 4.17,7.62 4.17,11.42 3,12.59 J3.3 | 14.33,5.33 15.85,6.86 17.07,6.86 R4.2 | v31.39,31.09 31.39,31.85 L1.8 | 29.57,4.88 27.13,2.44 17.22,2.44 14.33,5.33
  other vias: 50.4,30.4 47.71,24.13 27.26,11.75 23.45,19.04 44.83,23.32
  pour Top: -73.29,111.76 -73.29,-31.91 -58.88,-46.32 118.78,-46.32 168.91,3.81 168.91,105.41 162.56,111.76
  pour Route15: 66.8,52.4 71.2,48 71.2,-0.8 65.6,-6.4 27.8,-6.4 4.8,-6.4 -5.6,4 -5.8,4.2 -5.8,48.2 -1.6,52.4
5V  (via drill 0.5, 1)
  Top 0.2: CN1.VBUS 8.77,33.09 9.73,33.09 10.41,32.41 10.41,23.53 11.47,22.46 11.47,21.61
  Top 0.5: 13.44,26.2 13.24,26 v11.6,26
  Top 0.7: 10.17,21.61 10.17,19.55 10.16,19.54 10.16,16.45 9.73,16.02 9.94,16.02 11,14.96 12.2,14.96 13.04,15.8 13.04,17 12.77,17.27 12.77,18.07 13.04,18.34 13.04,19.54 12.82,19.76 12.82,22.63 13.21,23.02
  Top 1: SERVO1.2 SERVO2.2 SERVO3.2 10.17,21.61 11.47,21.61 J2.3 | 9.73,16.02 5V.1 6.11,13.6 v5.4,13.6
  Top 1.5: IC5.3 60.29,27.41 62.05,29.18 62.05,36.02 61.52,36.55 54.65,36.55 54.6,36.6 18.47,36.6 13.44,31.57 13.44,26.2 13.44,23.26 13.21,23.02 12.36,22.18 12.04,22.18 11.47,21.61
  Bottom 0.5: v11.6,26 11.5,26.1 C5.2
  Bottom 1: v5.4,13.6 6.76,12.24 6.76,10.87 11.31,6.31 IC1.1
BUZ  (via drill 0.35)
  Top 0.152: v16.8,17.67 16.65,17.53 15.7,17.53 U1.12
  Route15 0.152: LS1.+ 41.6,26.82 41.3,26.82 32.16,17.68 18.66,17.68 18.36,17.98 17.61,17.98 17.3,17.67 v16.8,17.67
ESP_CS  (via drill 0.35)
  Top 0.152: v14.17,15.24 14.17,17.07 14.94,17.83 15.54,17.83 U1.11 | v25.76,10.52 25.76,5.49 27.28,3.96 27.28,3.5 X1.10
  Route2 0.152: v14.17,15.24 14.48,15.24 15.39,14.33 16.15,14.33 17.22,15.39 20.88,15.39 v25.76,10.52
FLASHCS  (via drill 0.35)
  Top 0.152: v14.48,19.66 14.63,19.51 15.54,19.51 U1.7 | v15.7,14.94 14.78,14.02 14.78,10.06 15.39,9.45 15.39,5.94 L2.1
  Route2 0.152: v14.48,19.66 15.7,18.44 v15.7,14.94
GND  (via drill 0.35)
  Top 0.152: RST.3 59.28,7.62 v59.28,9.6 59.28,11.58 RST.4 59.13,11.73 59.13,20.42 | HM1.5 45.26,30.63 45.11,30.63 44.81,30.94 44.81,31.55 45.26,32 HM1.7 45.41,31.85 46.02,32.46 47.4,32.46 HM1.1 47.55,32.61 57.91,32.61 IC5.2 58.06,32.46 58.83,31.7 58.83,24.69 59.13,24.38 59.13,20.42 | 19.36,5.79 22.86,5.79 25.15,3.5 X1.9 | 14.78,3.35 15.54,3.35 16.92,4.72 18.29,4.72 19.36,5.79 | 14.78,3.35 11.58,3.35 ESP_PROG.4 11.43,3.35 7.47,3.35 ESP_PROG.3 8.08,4.08 8.08,5.89 7.81,6.17 v7.81,6.75 | 19.36,5.79 L2.4 19.2,8.24 v19.1,8.35 | U1.19 17.98,15.85 v17.98,17.07 17.98,18.29 18.9,19.2 U1.EPAD | 46.94,22.25 46.94,22.86 IC2.2 46.94,23.01 46.94,23.62 44.81,25.76 36.42,25.76 35.36,26.82 LS1.- | 46.94,22.25 46.94,21.79 46.63,21.49 46.63,20.73 IC2.15 | 49.07,22.25 49.07,22.86 IC2.6 | 49.07,22.25 49.07,20.73 IC2.10 | 48.31,22.25 48.16,22.4 48.16,22.86 IC2.4 | 49.07,22.25 48.31,22.25 | 48.31,22.25 46.94,22.25 | CN1.GND 8.53,30.18 8.99,30.18 10.06,29.11 10.06,25.6 8.69,24.23 SERVO3.3 | J3.4 3.05,16 4.27,14.78 4.27,13.26 6.4,11.12 7.32,11.12 RP2040-PROG.1 7.47,11.12 11.43,11.12 RP2040-PROG.2 11.58,10.97 12.46,10.97 | 14.78,3.35 14.78,8.38 15.09,8.69 15.09,9.3 13.41,10.97 12.46,10.97 | 59.13,20.42 v59.89,20.42 | v12.38,11.84 12.46,11.75 12.46,10.97
  Route15 0.152: v17.98,17.07 19.1,15.95 19.1,15.08 19.05,15.03 19.05,14.53 19.1,14.49 v19.1,8.35 | v38.62,16.08 38.62,15.09 38.56,15.03 38.56,14.83 v36.65,12.92
  Bottom 0.152: Q2.2 41.45,14.94 41.45,14.87 | v59.89,20.42 59.89,20.27 60.5,19.66 61.11,19.66 61.57,20.12 62.03,20.12 J1.6 | L1.4 24.23,35.81 24.27,35.81
  other vias: 11.35,30.62 14.03,36.07 18.77,34.96 26.46,34.98 26.16,13.26 28.21,11.77
  pour Bottom: 0,104.14 -11.43,92.71 -11.43,80.01 -11.43,8.89 7.62,-10.16 152.4,-10.16 166.37,3.81 166.37,95.25 157.48,104.14
  pour Route2: 67.4,49 67.4,0.8 62.2,-4.4 3.6,-4.4 -2.8,2 -2.8,43.2 0,46 3,49
LEDB  (via drill 0.35)
  Top 0.152: v23.72,20.94 23.75,20.91 23.75,19.77 24.15,19.37 24.15,18.66 23.01,17.53 22.55,17.53 U1.31
  Bottom 0.152: v23.72,20.94 18.38,20.94 16.92,22.4 15.24,22.4 R19.1
LEDG  (via drill 0.35)
  Top 0.152: v33.98,15.7 30.63,15.7 29.87,16.46 29.87,17.07 30.18,17.37 30.18,19.51 28.96,20.73 24.38,20.73 24.07,20.42 24.07,19.87 24.45,19.5 24.45,18.51 23.01,17.07 22.55,17.07 U1.30
  Bottom 0.152: v33.98,15.7 33.98,10.67 35.36,9.3 R18.1
LEDR  (via drill 0.35)
  Top 0.152: U1.29 22.55,16.61 23.93,15.24 24.3,15.24 25.11,14.43 25.11,12.01 v23.32,10.21
  Bottom 0.152: v23.32,10.21 22.71,9.6 22.71,7.16 26.21,3.66 R20.2
MISO  (via drill 0.35)
  Top 0.152: 26.36,20.12 27.58,20.12 29.26,18.44 X1.6 | 26.36,20.12 v24.69,20.12 | U1.6 15.7,19.81 16.07,19.81 16.07,19.8 16.23,19.64 16.23,19.01 16.25,18.99 v16.54,18.99 | v60.81,20.27 60.81,18.9 59.74,17.83 v59.74,16.31 | v45.11,9.75 32.16,9.75 30.74,11.17 | 30.74,11.17 26.36,15.54 26.36,20.12 | L2.2 16.76,5.94 16.76,8.69 17.68,9.6 23.77,9.6 25,10.83 25.21,10.83 25.5,11.12 29.41,11.12 29.46,11.17 30.74,11.17
  Bottom 0.152: v16.54,18.99 16,18.99 16,21.34 16.76,22.1 18.75,20.12 v24.69,20.12 | v60.81,20.27 61.42,20.88 61.57,20.88 62.03,21.34 J1.7 | v59.74,16.31 58.83,16.31 52.27,9.75 v45.11,9.75
MOSI  (via drill 0.35)
  Top 0.152: v16.61,20.29 16.59,20.27 15.7,20.27 U1.5 | v20.27,14.02 19.36,13.11 L2.5 | v56.69,16.92 38.25,16.92 36.42,15.09 30.63,15.09 28.19,17.53 | X1.7 28.19,17.53 | v26.98,16.15 28.19,17.37 28.19,17.53
  Route2 0.152: v16.61,20.29 19.49,20.29 20.95,18.83 22.78,18.83 24.58,17.03 24.16,16.61 21.89,16.61 21.59,16.31 21.09,16.31 20.73,16.66 20.73,17.04 20.36,17.41 19.86,17.41 19.5,17.05 19.5,16.55 19.86,16.2 20.34,16.2 20.83,15.7 21.84,15.7 22.14,16 24.42,16 24.96,16.55 25.35,16.16 25.86,16.16 26.19,16.5 26.63,16.5 v26.98,16.15
  Bottom 0.152: v16.61,20.29 16.61,19.81 17.83,18.59 17.84,18.59 19.47,16.96 19.47,16.46 20.27,15.67 v20.27,14.02 | v56.69,16.92 62.03,16.92 J1.3
N$1
  Bottom 1: R12.1 29.84,35.04 29.84,36.4 31.4,37.96 PYRO2.2
N$2  (via drill 0.35)
  Top 0.152: RP2040-PROG.3 7.47,8.99 11.43,8.99 RP2040-PROG.4 11.58,8.99 v14.48,8.99
  Route2 0.152: v21,12.53 18.39,9.91 17.65,9.91 16.73,8.99 v14.48,8.99
  Bottom 0.152: R3.2 21.93,13.46 v21,12.53
N$3  (via drill 0.35)
  Top 0.152: ESP_PROG.2 11.43,5.49 8.41,5.49 8.41,7 8.06,7.35 7.55,7.35 7.2,7 7.2,6.34 7.47,6.08 7.47,5.49 ESP_PROG.1 7.32,5.33 6.55,4.57 6.55,2.9 6.71,2.74 16.76,2.74 18.44,4.42 v18.9,4.42
  Bottom 0.152: v18.9,4.42 21.79,7.32 21.79,8.69 R8.1
N$4  (via drill 0.35)
  Top 0.152: RST.2 57.15,11.58 57.15,7.62 RST.1 57,7.47 50.6,7.47 v47.7,4.57
  Route2 0.152: v32.77,16.61 33.68,16.61 33.98,16.31 35.97,16.31 v47.7,4.57
  Bottom 0.152: v32.77,16.61 31.85,16.61 30.33,18.14 R6.1
N$5  (via drill 0.35)
  Top 0.152: v9.45,28.8 8.08,28.8 7.01,29.87 7.01,31.39 7.32,31.7 8.38,31.7 CN1.D+
  Route2 0.152: v21.95,25.3 20.42,26.82 12.34,26.82 10.36,28.8 v9.45,28.8
  Bottom 0.152: v21.95,25.3 22.25,25.6 27.58,25.6 27.89,25.3 28.65,25.3 29.57,26.21 R1.1
N$6  (via drill 0.35)
  Top 0.152: CN1.D- 8.38,32.61 7.47,32.61 7.01,33.07 7.01,33.68 7.32,33.98 9.6,33.98 9.91,33.68 9.91,33.53 v12.04,31.39
  Route2 0.152: v24.99,24.08 18.59,30.48 12.95,30.48 v12.04,31.39
  Bottom 0.152: v24.99,24.08 24.99,23.62 26.98,21.64 30.48,21.64 R2.1
N$7
  Bottom 0.152: 37.34,17.98 36.88,17.98 Q1.7 36.73,17.98 36.12,17.98 Q1.6 35.97,17.83 35.69,17.55 | 37.34,17.98 Q1.8 | Q1.5 35.51,17.98 35.38,17.86 | Q1.11 35.66,17.57 Q1.9 | Q1.10 37.34,17.79 37.34,17.98
  Bottom 1: Q1.9 35.69,17.55 35.38,17.86 33.82,19.42 33.82,22.71 32.82,23.71 32.82,27.36 32.44,27.74 28.7,27.74 27.41,26.45 23.43,26.45 20.93,26.45 20.55,26.83 20.55,29.17 22.74,31.36 22.74,36.4 23.12,36.78 24.18,36.78 PYRO2.1
N$8
  Bottom 1: PYRO3.2 43.8,35.75 43.41,35.35 43.41,24.01 R14.1
N$9
  Bottom 0.152: Q5.7 10.21,34.44 10.21,34.9 Q5.8 10.41,35.16 Q5.10 | Q5.7 10.21,34.29 10.21,33.68 Q5.6 10.21,33.53 10.21,33.07 Q5.5 10.46,33.01 Q5.11 | Q5.7 10.36,34.44 10.97,34.44 Q5.9
  Bottom 1: PYRO1.1 11.36,36.29 Q5.9
N$10  (via drill 0.35)
  Top 0.152: v27.28,7.01 28.04,6.25 28.5,6.25 31.24,3.5 X1.12
  Bottom 0.152: R8.2 23.77,8.69 25.6,8.69 25.91,8.38 R7.1 26.06,8.23 v27.28,7.01
N$11
  Bottom 0.152: 39.97,17.87 40.08,17.98 40.04,17.98 Q2.5 40.01,17.74 Q2.11 | 40.2,17.64 40.54,17.98 Q2.6 | Q2.9 41,17.53 41.3,17.83 Q2.7 41.45,17.98 41.91,17.98 Q2.8 42.16,17.79 Q2.10
  Bottom 1: PYRO3.1 38.8,19.04 39.97,17.87 40.2,17.64 Q2.9
N$12
  Bottom 0.152: IC3.6 61.11,30.79 57.15,30.79 56.54,31.39 55.78,31.39 IC3.16
N$13  (via drill 0.35)
  Top 0.152: v44.81,24.84 v31.55,24.84
  Route15 0.152: v46.18,31.55 46.63,31.09 v46.63,30.33
  Bottom 0.152: v46.18,31.55 45.57,32.16 44.81,32.16 S1.3 | S1.1 44.81,34.59 45.11,34.59 47.09,32.61 47.09,31.09 46.63,30.63 v46.63,30.33 44.81,28.5 v44.81,24.84 | v31.55,24.84 31.55,26.21 R1.2
N$14  (via drill 1)
  Top 1: v48.4,7.8 50.6,10 52.8,10 57.75,14.95 57.75,19.89 55.71,21.93 IC5.1
  Bottom 1: v48.4,7.8 48.4,6.76 R16.2
N$16
  Bottom 1: R17.1 45.47,39.57 45.47,39.69 44.49,40.67 25.11,40.67 23.39,38.94 PYRO1.2
N$17
  Bottom 0.152: S1.2 44.81,33.38 45.26,33.38 46.79,31.85 46.79,31.24 46.48,30.94 44.81,30.94 S1.4 44.65,30.79 44.2,30.33 44.2,17.68 42.22,15.7 39.17,15.7 38.56,15.09 38.56,14.94 37.64,14.02 35.2,14.02 34.9,14.33 34.9,17.22 32.61,19.51 32.61,21.49 R2.2
N$18  (via drill 0.35)
  Top 0.152: U1.20 18.33,15.76 v18.33,14.64 | v17.53,8.53 18.25,9.26 21.52,9.26 26.36,4.42 26.36,2.29 27.28,1.37 48.92,1.37 51.36,3.81 F1.2
  Bottom 0.152: v18.33,14.64 17.4,13.72 16.46,13.72 16.15,13.41 16.15,10.82 17.07,9.91 C3.2 17.22,9.75 17.22,8.84 v17.53,8.53
N$19  (via drill 0.35)
  Top 0.152: v21.34,16.92 20.84,17.41 20.04,17.41 20,17.44 18.96,17.44 18.59,17.07 18.59,16.82 18.3,16.53 18.34,16.5 18.57,16.5 18.8,16.27 U1.21 | v29.26,13.56 51.36,13.56 F1.1
  Route15 0.152: v21.34,16.92 25.45,16.92 v25.6,16.76
  Bottom 0.152: v25.6,16.76 27.58,16.76 30.02,14.33 | 30.02,14.33 30.48,13.87 C2.2 30.02,14.33 | 30.02,14.33 v29.26,13.56
N$23  (via drill 0.35)
  Top 0.152: v44.96,37.95 44.65,37.64 43.28,37.64 39.17,41.76 8.23,41.76 7.62,41.15 7.01,41.15 LED1.3
  Bottom 0.152: v44.96,37.95 44.96,36.12 47.4,33.68 47.4,29.98 45.44,28.02 45.44,17.24 37.49,9.3 R18.2
N$24  (via drill 0.35)
  Top 0.152: v21.18,19.51 21.95,20.27 22.4,20.27 U1.38
  Bottom 0.152: v21.18,19.51 21.18,17.68 20.73,17.22 20.73,14.94 21.03,14.63 22.86,14.63 23.01,14.48 23.01,12.95 21.49,11.43 18.29,11.43 18.14,11.58 | 18.14,11.58 17.22,12.5 R10.2 | 18.14,11.58 18.14,5.94 18.29,5.79 19.66,5.79 20.88,7.01 20.88,9.6 22.1,10.82 23.93,10.82 25.2,10.82 25.5,11.12 28.74,11.12 28.93,11.31 28.93,11.97 29.09,12.14 29.09,12.19 30.48,12.19 30.79,11.89 30.79,7.01 31.7,6.1 R9.1
N$25  (via drill 0.35)
  Top 0.152: v14.48,34.44 12.8,34.44 7.47,39.78 7.01,39.78 LED1.4
  Bottom 0.152: v14.48,34.44 14.48,33.83 14.17,33.53 14.17,31.85 13.87,31.55 13.87,25.6 15.09,24.38 R19.2
N$26  (via drill 0.35)
  Top 0.152: LED1.2 9.6,40.1 10.63,40.1 10.99,39.74 10.99,39.24 10.31,38.56 v9.6,38.56
  Route15 0.152: v16.92,3.81 v14.17,6.55
  Bottom 0.152: v9.6,38.56 9.6,29.57 10.06,29.11 10.06,16.15 11.27,14.94 11.27,8.97 13.69,6.55 v14.17,6.55 | v16.92,3.81 24.23,3.81 24.38,3.66 R20.1
PYRO1  (via drill 0.35)
  Top 0.152: v14.78,16.15 14.78,16.76 15.09,17.07 15.54,17.07 U1.13
  Bottom 0.152: R11.2 14.33,12.34 14.78,12.8 v14.78,16.15 13.26,17.68 11.12,17.68 10.36,18.44 10.36,30.63 12.65,32.92 13.26,32.92 Q5.4
PYRO2  (via drill 0.35)
  Top 0.152: v13.26,14.17 14.02,14.17 15.54,15.7 15.54,16.61 U1.14 | v34.29,30.63 33.22,30.63 32.16,31.7 20.57,31.7 19.66,30.79 v19.66,30.48
  Route15 0.152: v13.26,14.17 13.26,21.93 13.29,21.93 18.44,27.08 18.44,27.81 18.45,27.82 18.45,28.05 19.66,29.26 v19.66,30.48
  Bottom 0.152: v19.66,30.48 19.66,32 20.57,32.92 R13.2 | v34.29,30.63 33.98,30.33 33.98,26.52 34.59,25.91 34.59,20.73 35.05,20.27 35.97,20.27 37.95,18.29 37.95,16 37.64,15.7 35.81,15.7 35.51,15.39 35.51,14.94 Q1.4
PYRO3  (via drill 0.35)
  Top 0.152: v22.86,11.43 21.64,10.21 17.83,10.21 16,12.04 16,13.87 16.31,14.17 16.31,15.7 U1.15 | v39.17,14.78 28.96,14.78 v28.8,14.63
  Bottom 0.152: v22.86,11.43 24.08,11.43 25.17,12.52 27.43,12.52 27.53,12.62 27.53,14.8 R15.2 27.58,14.78 27.74,14.63 v28.8,14.63 | v39.17,14.78 39.93,14.78 Q2.4
QSPI_CS  (via drill 0.35)
  Top 0.152: v19.36,27.43 16.31,24.38 16.31,22.71 U1.56 | v20.88,31.09 v23.77,31.09
  Bottom 0.152: 22.1,15.85 21.95,15.7 R3.1 22.1,15.85 | 22.1,15.85 25.3,19.05 25.3,22.86 24.54,23.62 22.71,23.62 19.36,26.98 v19.36,27.43 19.36,29.11 20.88,30.63 v20.88,31.09 | R4.1 20.33,6.95 20.57,7.19 20.57,10.06 23.32,12.8 23.32,14.63 22.1,15.85 | v23.77,31.09 24.08,31.39 24.08,31.85 L1.1
QSPI_SCK  (via drill 0.35)
  Top 0.152: U1.52 18.07,22.78 18.07,23.25 18.5,23.68 18.97,23.68 21.56,26.26 27.84,26.26 28.09,26.52 28.6,26.52 28.95,26.16 28.95,26.03 v30.23,24.76
  Route2 0.152: v30.23,24.76 30.23,32.14 v29.4,32.96
  Bottom 0.152: L1.6 30.57,33.82 30.39,33.82 29.54,32.96 v29.4,32.96
QSPI_SD0  (via drill 0.35)
  Top 0.152: U1.53 17.67,22.78 17.67,23.28 21.39,26.99 33.57,26.99 35.02,25.55 v35.47,25.55
  Route2 0.152: v33.08,35.05 35.21,32.92 35.21,28.31 36.16,27.36 36.16,26.58 35.47,25.89 v35.47,25.55
  Bottom 0.152: v33.08,35.05 32.23,35.05 32.19,35.09 32.01,35.09 L1.5
QSPI_SD1  (via drill 0.35)
  Top 0.152: v18.29,25.45 16.76,23.93 16.76,22.71 U1.55
  Route15 0.152: v23.16,30.33 v18.29,25.45
  Bottom 0.152: v23.16,30.33 24.08,30.33 25.3,31.55 25.3,32.46 24.54,33.22 24.23,33.22 L1.2
QSPI_SD2  (via drill 0.35)
  Top 0.152: v24.97,27.64 21.54,27.64 17.22,23.32 17.22,22.71 U1.54
  Route15 0.152: v24.97,27.64 24.97,31.68 v25.91,32.61
  Bottom 0.152: v25.91,32.61 25.91,33.07 24.54,34.44 24.23,34.44 L1.3
QSPI_SD3  (via drill 0.35)
  Top 0.152: U1.51 18.44,22.71 18.44,23.18 18.63,23.37 19.1,23.37 21.63,25.91 v28.35,25.91
  Route15 0.152: v28.35,25.91 28.35,27.58 28.96,28.19 v28.96,30.63
  Bottom 0.152: v28.96,30.63 28.96,31.24 30.94,33.22 31.24,33.22 L1.7
RST  (via drill 0.35)
  Top 0.152: v34.29,16.92 37.8,16.92 39.17,18.29 X1.1 | U1.26 20.73,15.9 20.73,16.34 20.57,16.5 20.41,16.5 v20.11,16.8
  Route2 0.152: v33.09,11.39 27.68,16.8 26.42,16.8 25.86,17.37 25.35,17.37 24.29,16.31 22.02,16.31 21.71,16 20.96,16 20.16,16.8 v20.11,16.8
  Bottom 0.152: 32.75,12.02 33.38,12.65 33.38,16.92 | 32.75,12.02 31.85,11.12 R5.2 | 33.38,16.92 32.16,18.14 R6.2 | 33.38,16.92 v34.29,16.92 | 32.75,12.02 32.75,11.74 v33.09,11.39
RX0  (via drill 0.35)
  Top 0.152: U1.28 21.64,15.7 21.64,14.48 v20.27,13.11
  Route2 0.152: v20.27,13.11 19.36,14.02 14.33,14.02 12.04,16.31 11.73,16.31 J2.1
RXE  (via drill 0.35)
  Top 0.152: v48.31,32 v53.03,32 | v39.47,9.14 39.47,5.64 37.34,3.5 X1.15
  Bottom 0.152: v53.03,32 54.86,33.83 55.63,33.83 IC3.20 | v39.47,9.14 48.45,18.13 48.45,30.85 48.31,30.99 v48.31,32
SCK  (via drill 0.35)
  Top 0.152: v14.78,31.09 14.48,30.79 14.48,21.18 14.94,20.73 15.54,20.73 U1.4 | v18.59,33.83 v32.61,33.83 33.38,33.83 35.81,31.39 v39.93,31.39 | v53.03,19.36 40.39,19.36 39.93,19.81 | 39.93,19.81 32.61,19.81 31.24,18.44 X1.5 31.24,18.29 30.48,17.53 v30.48,16.76 | 39.93,19.81 v39.93,20.88 | L2.6 18,12.91 18,11.9 18.44,11.46 21.22,11.46 21.91,12.15 21.91,12.31 v23.93,14.33
  Route2 0.152: v57.45,21.95 56.69,21.18 54.86,21.18 v53.03,19.36
  Bottom 0.152: v14.78,31.09 14.78,32 16.61,33.83 v18.59,33.83 | v57.45,21.95 60.2,19.2 62.03,19.2 J1.5 | v23.93,14.33 23.93,16 25.3,17.37 29.26,17.37 29.87,16.76 v30.48,16.76 | v39.93,20.88 v39.93,31.39
SCL  (via drill 0.35)
  Top 0.152: 55.32,28.65 55.93,28.04 56.54,28.04 58.52,26.06 58.52,14.63 51.66,7.77 49.84,7.77 44.2,2.13 36.58,2.13 35.36,3.35 X1.14 35.2,3.35 33.83,1.98 v28.19,1.98 | HM1.4 47.55,30.48 49.4,30.48 50.12,31.2 52.77,31.2 55.32,28.65 | v50.44,22.55 49.99,22.1 49.99,21.79 IC2.8 | v53.65,23.62 53.65,26.98 55.32,28.65 | v16.77,21.22 16.62,21.07 U1.3
  Route2 0.152: v16.77,21.22 15.12,21.22 12.95,19.05 12.95,18.44 12.19,17.68 12.04,17.68 11.89,17.83 11.28,17.83 11.12,17.68 10.97,17.68 9.91,16.61 9.91,15.39 3.96,9.45 3.81,9.45 2.9,8.53 J3.1
  Bottom 0.152: v50.44,22.55 52.58,22.55 v53.65,23.62 | v28.19,1.98 8.84,1.98 3.05,7.77 3.05,8.38 J3.1
SD_CS  (via drill 0.35)
  Top 0.152: v14.48,18.75 14.78,19.05 15.54,19.05 U1.8
  Route15 0.152: v14.48,18.75 14.48,17.45 16.54,15.39 18.79,15.39 18.79,15.83 18.16,16.46 17.73,16.46 17.38,16.82 17.38,17.32 17.73,17.68 18.23,17.68 18.59,17.32 18.59,16.89 19.4,16.08 19.4,15.39 19.96,15.39 v28.5,6.86
  Bottom 0.152: v28.5,6.86 29.11,6.86 30.94,5.03 34.44,5.03 35.51,6.1 37.19,6.1 39.47,3.81 39.47,2.74 39.62,2.59 48.62,2.59 62.03,16 J1.2
SD_DETECT  (via drill 0.35)
  Top 0.152: U1.37 22.51,19.94 22.95,19.94 23.11,20.11 23.11,21.19 23.62,21.7 v25.96,21.7
  Route2 0.152: v49.54,18.37 46.22,21.7 v25.96,21.7
  Bottom 0.152: v49.54,18.37 49.54,17.26 J1.10
SDA  (via drill 0.35)
  Top 0.152: v15.09,25.6 14.78,25.3 14.78,21.79 15.09,21.49 15.54,21.49 U1.2 | v48.92,31.24 47.55,31.24 HM1.3 | v50.29,21.03 49.84,21.03 49.53,20.73 IC2.9 | v37.19,7.32 35.81,5.94 | 35.81,5.94 33.38,3.5 X1.13 | v36.42,5.49 35.97,5.94 35.81,5.94
  Bottom 0.152: v15.09,25.6 15.09,29.87 14.17,30.79 14.17,31.39 14.48,31.7 14.48,33.38 15.39,34.29 15.39,39.93 15.09,40.23 9.3,40.23 1.83,32.77 1.83,12.04 2.9,10.97 J3.2 2.9,10.82 2.9,10.06 1.83,8.99 1.83,7.77 8.23,1.37 34.44,1.37 36.42,3.35 v36.42,5.49 | v48.92,31.24 48.92,30.36 49.22,30.06 49.22,27.39 49.35,27.26 50.29,27.26 52.84,24.71 52.33,24.2 49.03,24.2 48.92,24.08 48.77,24.08 | 48.92,24.23 48.77,24.08 | 48.77,24.08 48.77,22.55 48.92,22.4 v50.29,21.03 48.77,19.51 48.77,17.53 38.56,7.32 v37.19,7.32
SERVO1  (via drill 0.35)
  Top 0.152: v20.27,10.82 18.59,10.82 17.37,12.04 17.37,13.72 16.76,14.33 16.76,15.7 U1.16
  Route15 0.152: SERVO1.1 3.05,19.05 3.35,19.05 4.72,17.68 8.84,17.68 9.91,16.61 9.91,16.15 12.5,13.56 17.53,13.56 18.79,12.3 18.79,8.9 18.49,8.6 18.49,8.1 18.85,7.74 19.35,7.74 19.71,8.1 19.71,8.6 19.4,8.9 19.4,10.82 v20.27,10.82
SERVO2  (via drill 0.35)
  Top 0.152: v17.37,14.63 17.22,14.78 17.22,15.7 U1.17
  Bottom 0.152: v17.37,14.63 16.92,14.63 15.39,13.11 15.39,6.86 14.48,5.94 13.87,5.94 10.97,8.85 10.97,14.79 9.75,16 9.75,16.46 8.38,17.83 7.16,17.83 5.94,19.05 SERVO2.1
SERVO3  (via drill 0.35)
  Top 0.152: U1.18 17.53,15.9 17.53,16.34 17.09,16.79 v16.59,16.79
  Route2 0.152: SERVO3.1 8.5,19.07 v7.24,20.34
  Route15 0.152: v7.24,20.34 7.67,20.77 7.67,22.02 8.25,22.6 8.78,22.6 11.19,25.01 11.59,25.01 17.77,31.19 19.99,31.19 19.99,31.01 20.27,30.73 20.27,30.23 19.99,29.95 19.99,28.6 19.43,28.04 19.1,28.04 18.75,27.68 18.75,26.95 15.63,23.83 15.63,17.75 v16.59,16.79
TX0  (via drill 0.35)
  Top 0.152: v19.66,14.78 20.73,14.78 21.18,15.24 21.18,15.7 U1.27
  Bottom 0.152: J2.2 11.73,18.9 12.5,18.9 14.08,17.32 15.1,18.33 17.59,18.33 19.12,16.8 19.12,16.33 19.66,15.79 v19.66,14.78
TXE  (via drill 0.35)
  Top 0.152: v59.44,28.5 59.44,28.04 59.28,27.89 59.28,24.69 61.57,22.4 61.57,17.22 v60.66,16.31 | v47.4,8.84 44.65,8.84 39.32,3.5 X1.16
  Bottom 0.152: v59.44,28.5 60.2,27.74 62.03,27.74 62.33,28.04 62.33,31.7 62.03,32 61.27,32 IC3.4 | v60.66,16.31 53.19,8.84 v47.4,8.84
USBD+  (via drill 0.35)
  Top 0.152: v29.11,24.84 28.5,24.84 27.74,25.6 26.21,25.6 25.3,24.69 21.34,24.69 19.96,23.32 19.96,22.71 U1.47
  Route15 0.152: v29.11,24.84 29.11,27.43 v32.31,30.63
  Bottom 0.152: v32.31,30.63 32.77,30.63 36.73,34.59 37.03,34.59 S1.8
USBD+1  (via drill 0.35)
  Top 0.152: v35.81,32.31 44.35,32.31 45.26,33.22 v48.01,33.22
  Bottom 0.152: v35.81,32.31 37.03,32.31 S1.6 | v48.01,33.22 48.92,33.22 52.58,29.57 52.73,29.57 53.19,29.11 53.19,28.96 53.8,28.35 55.63,28.35 IC3.11
USBD-  (via drill 0.35)
  Top 0.152: v33.98,25.6 31.39,25.6 30.94,25.15 30.94,24.59 31.07,24.46 31.07,22.25 26.36,22.25 25.15,23.47 20.57,23.47 20.42,23.32 20.42,22.71 U1.46
  Bottom 0.152: v33.98,25.6 33.98,26.06 33.68,26.36 33.68,31.09 35.97,33.38 37.03,33.38 S1.7
USBD-1  (via drill 0.35)
  Top 0.152: v35.81,30.79 43.95,30.79 47.67,27.06 51.6,27.06 v53.8,29.26
  Bottom 0.152: v35.81,30.79 37.03,30.79 S1.5 | v53.8,29.26 54.71,29.26 55.02,28.96 55.63,28.96 IC3.12
VIN  (via drill 1, 2)
  Top 1: 37.4,29.01 37.4,27 v37.2,26.8
  Top 1.5: C4.+ 19.24,28.98 CON1.+
  Top 2: CON1.+ 34.35,28.98 34.38,29.01 37.4,29.01 43.84,29.01 47.05,25.8 52,25.8 52,22.6 v55.6,19
  Bottom 0.152: 40.61,6.71 36.88,6.71 35.81,7.77 31.85,7.77 R9.2
  Bottom 1: R12.2 17.7,27.5 17.7,29.01 16.25,30.47 C4.+ | v37.2,26.8 37.2,23.4 R14.2
  Bottom 1.5: R16.1
  Bottom 2: R17.2 55.6,23.84 v55.6,19 51.17,14.57 47.64,14.57 40.61,7.54 40.61,6.71 R16.1

### Text on the board
bNames: Brian Wong, 2023